# EAGLE design Sensor Board (EAGLE 6.4)

## Sheet 1 of 7: Microcontroller
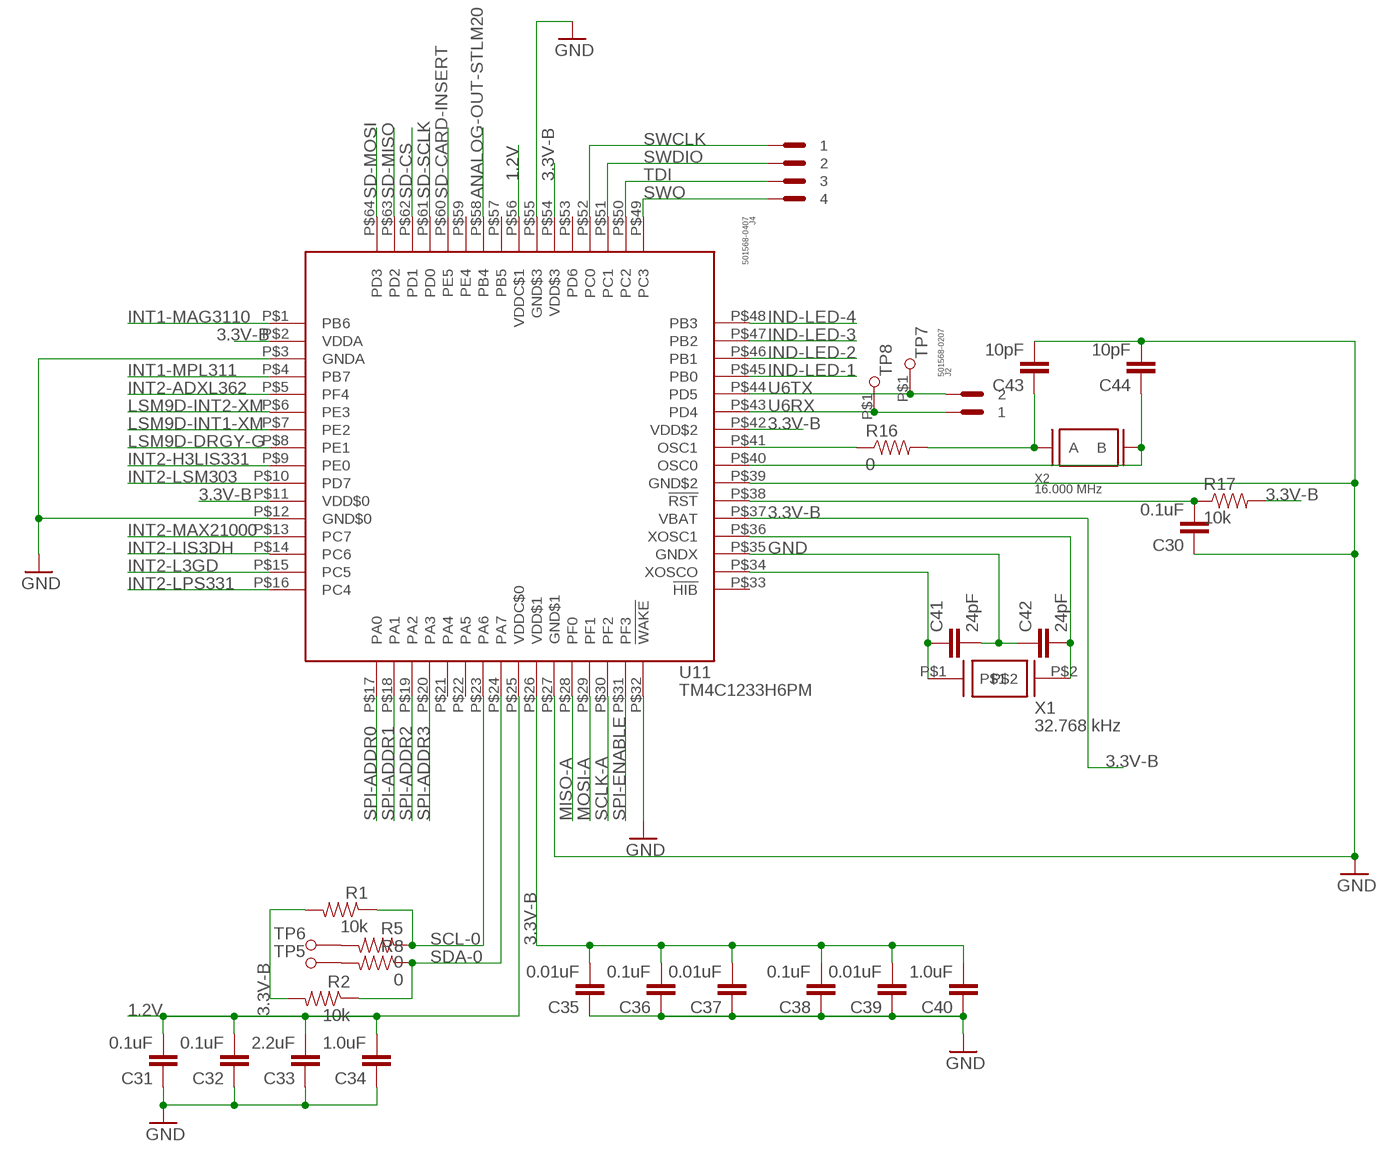
[diagram p0: schematic, sheet 1]

### Parts
C30  0.1uF  CAPACITOR0402  [C0402]
C31  0.1uF  CAPACITOR0402  [C0402]
C32  0.1uF  CAPACITOR0402  [C0402]
C33  2.2uF  CAPACITOR0402  [C0402]
C34  1.0uF  CAPACITOR0402  [C0402]
C35  0.01uF  CAPACITOR0402  [C0402]
C36  0.1uF  CAPACITOR0402  [C0402]
C37  0.01uF  CAPACITOR0402  [C0402]
C38  0.1uF  CAPACITOR0402  [C0402]
C39  0.01uF  CAPACITOR0402  [C0402]
C40  1.0uF  CAPACITOR0402  [C0402]
C41  24pF  CAPACITOR0402  [C0402]
C42  24pF  CAPACITOR0402  [C0402]
C43  10pF  CAPACITOR0402  [C0402]
C44  10pF  CAPACITOR0402  [C0402]
J2  501568-0207  [501568-0207]
J4  501568-0407  [501568-0407]
R1  10k  RESISTOR  [R0402]
R2  10k  RESISTOR  [R0402]
R5  0  RESISTOR  [R0402]
R8  0  RESISTOR  [R0402]
R16  0  RESISTOR  [R0402]
R17  10k  RESISTOR  [R0402]
TP5  TESTPAD(ROUND)  [TESTPAD(ROUND)]
TP6  TESTPAD(ROUND)  [TESTPAD(ROUND)]
TP7  TESTPAD(ROUND)  [TESTPAD(ROUND)]
TP8  TESTPAD(ROUND)  [TESTPAD(ROUND)]
U11  TM4C1233H6PM  [S-PQFP-G64]
X1  32.768 kHz  ABS07L  [2-SMD(3.2X1.5)]
X2  16.000 MHz  NX3225GA  [4-SMD(3.2X2.5)]

### Nets
1.2V: C31.2 C32.2 C33.2 C34.2 U11.P$25(VDDC$0) U11.P$56(VDDC$1)
3.3V-B: C35.2 C36.2 C37.2 C38.2 C39.2 C40.2 R1.2 R2.2 R17.2 U11.P$2(VDDA) U11.P$11(VDD$0) U11.P$26(VDD$1) U11.P$37(VBAT) U11.P$42(VDD$2) U11.P$54(VDD$3) ; also sheet 4,6,7
ANALOG-OUT-STLM20: U11.P$58(PB4) ; also sheet 4
GND: C30.1 C31.1 C32.1 C33.1 C34.1 C35.1 C36.1 C37.1 C38.1 C39.1 C40.1 C41.2 C42.1 C43.2 C44.2 U11.P$3(GNDA) U11.P$12(GND$0) U11.P$27(GND$1) U11.P$32(!WAKE) U11.P$35(GNDX) U11.P$39(GND$2) U11.P$55(GND$3) ; also sheet 2,3,4,5,6,7
IND-LED-1: U11.P$45(PB0) ; also sheet 7
IND-LED-2: U11.P$46(PB1) ; also sheet 7
IND-LED-3: U11.P$47(PB2) ; also sheet 7
IND-LED-4: U11.P$48(PB3) ; also sheet 7
INT1-MAG3110: U11.P$1(PB6) ; also sheet 3
INT1-MPL311: U11.P$4(PB7) ; also sheet 4
INT2-ADXL362: U11.P$5(PF4) ; also sheet 2
INT2-H3LIS331: U11.P$9(PE0) ; also sheet 2
INT2-L3GD: U11.P$15(PC5) ; also sheet 3
INT2-LIS3DH: U11.P$14(PC6) ; also sheet 2
INT2-LPS331: U11.P$16(PC4) ; also sheet 4
INT2-LSM303: U11.P$10(PD7) ; also sheet 3
INT2-MAX21000: U11.P$13(PC7) ; also sheet 3
LSM9D-DRGY-G: U11.P$8(PE1) ; also sheet 5
LSM9D-INT1-XM: U11.P$7(PE2) ; also sheet 5
LSM9D-INT2-XM: U11.P$6(PE3) ; also sheet 5
MISO-A: U11.P$28(PF0) ; also sheet 6
MOSI-A: U11.P$29(PF1) ; also sheet 6
N$10: C30.2 R17.1 U11.P$38(!RST)
N$11: C42.2 U11.P$36(XOSC1) X1.P$2
N$12: C41.1 U11.P$34(XOSCO) X1.P$1
N$14: C43.1 R16.2 X2.P$1(A)
N$16: C44.1 U11.P$40(OSC0) X2.P$3(B)
N$17: R16.1 U11.P$41(OSC1)
N$24: R5.2 TP6.P$1
N$26: R8.2 TP5.P$1
SCL-0: R1.1 R5.1 U11.P$23(PA6) ; also sheet 3,4,5
SCLK-A: U11.P$30(PF2) ; also sheet 6
SD-CARD-INSERT: U11.P$60(PE5) ; also sheet 6
SD-CS: U11.P$62(PD1) ; also sheet 6
SD-MISO: U11.P$63(PD2) ; also sheet 6
SD-MOSI: U11.P$64(PD3) ; also sheet 6
SD-SCLK: U11.P$61(PD0) ; also sheet 6
SDA-0: R2.1 R8.1 U11.P$24(PA7) ; also sheet 3,4,5
SPI-ADDR0: U11.P$17(PA0) ; also sheet 6
SPI-ADDR1: U11.P$18(PA1) ; also sheet 6
SPI-ADDR2: U11.P$19(PA2) ; also sheet 6
SPI-ADDR3: U11.P$20(PA3) ; also sheet 6
SPI-ENABLE: U11.P$31(PF3)
SWCLK: J4.P$1 U11.P$52(PC0)
SWDIO: J4.P$2 U11.P$51(PC1)
SWO: J4.P$4 U11.P$49(PC3)
TDI: J4.P$3 U11.P$50(PC2)
U6RX: J2.P$1 TP8.P$1 U11.P$43(PD4)
U6TX: J2.P$2 TP7.P$1 U11.P$44(PD5)
Unconnected: U11.P$21(PA4) U11.P$22(PA5) U11.P$33(!HIB) U11.P$53(PD6) U11.P$57(PB5) U11.P$59(PE4)

## Sheet 2 of 7: Accelerometer
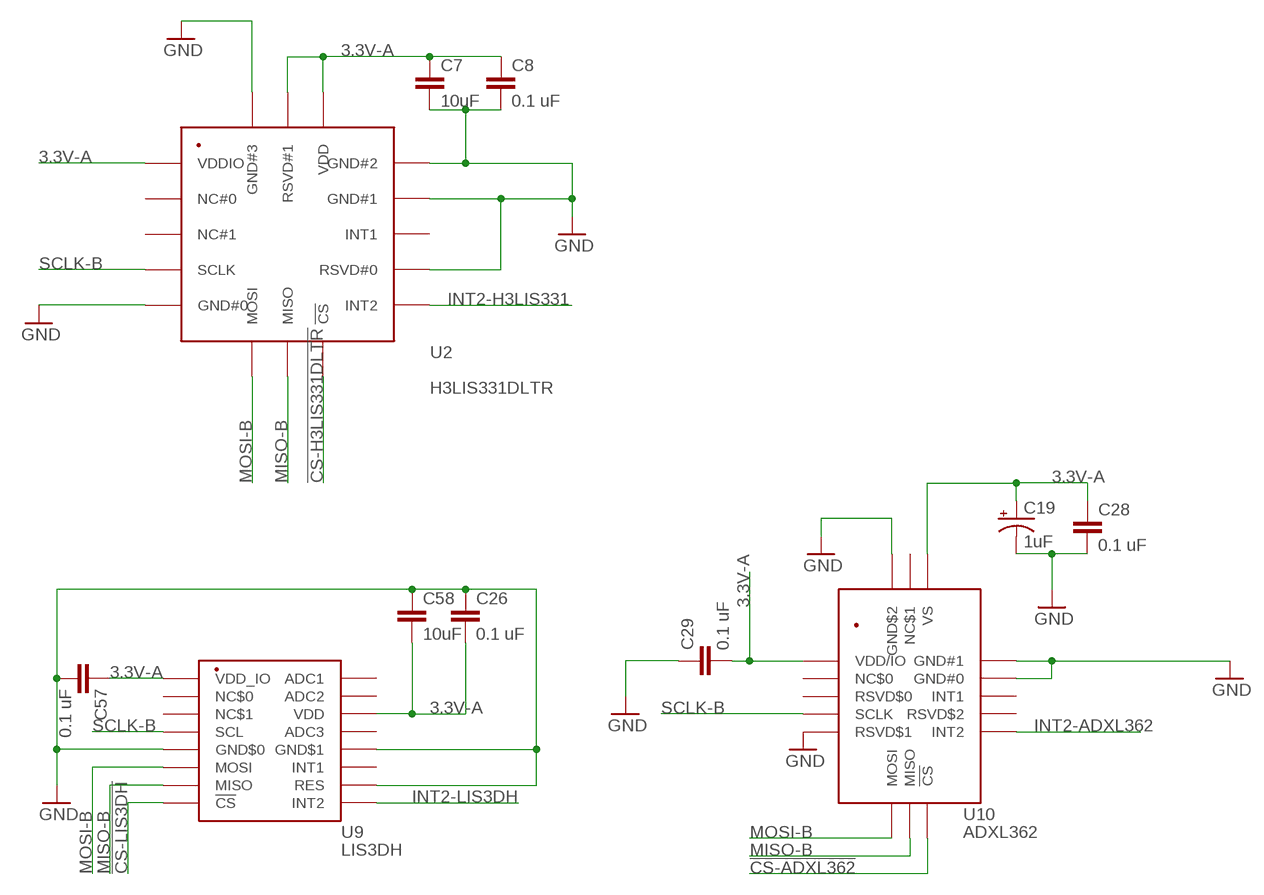
[diagram p1: schematic, sheet 2]

### Parts
C7  10uF  CAPACITOR10U-X5R-10%-6.3V  [C0603]
C8  0.1 uF  CAPACITOR0.1U-X7R-10%-25V  [C0402]
C19  1uF  CAP_POL6032  [EIA6032]
C26  0.1 uF  CAPACITOR0.1U-X7R-10%-25V  [C0402]
C28  0.1 uF  CAPACITOR0.1U-X7R-10%-50V  [C0402]
C29  0.1 uF  CAPACITOR0.1U-X7R-10%-50V  [C0402]
C57  0.1 uF  CAPACITOR0.1U-X7R-10%-25V  [C0402]
C58  10uF  CAPACITOR10U-X5R-10%-6.3V  [C0603]
U2  H3LIS331DLTR  [LGA-16(3X3)]
U9  LIS3DH  [LGA-16(3X3)]
U10  ADXL362  [LGA-16(3X3.25)]

### Nets
3.3V-A: C7.1 C8.1 C19.P$1(+) C26.2 C28.1 C29.2 C57.1 C58.2 U2.P$1(VDDIO) U2.P$14(VDD) U2.P$15(RSVD#1) U9.P$1(VDD_IO) U9.P$14(VDD) U10.P$1(VDD/IO) U10.P$14(VS) ; also sheet 3,4,5,7
!CS-ADXL362: U10.P$8(!CS) ; also sheet 6
!CS-H3LIS331DLTR: U2.P$8(!CS) ; also sheet 6
!CS-LIS3DH: U9.P$8(!CS) ; also sheet 6
GND: C7.2 C8.2 C19.P$2(-) C26.1 C28.2 C29.1 C57.2 C58.1 U2.P$5(GND#0) U2.P$10(RSVD#0) U2.P$12(GND#1) U2.P$13(GND#2) U2.P$16(GND#3) U9.P$5(GND$0) U9.P$10(RES) U9.P$12(GND$1) U10.P$5(RSVD$1) U10.P$12(GND#0) U10.P$13(GND#1) U10.P$16(GND$2) ; also sheet 1,3,4,5,6,7
INT2-ADXL362: U10.P$9(INT2) ; also sheet 1
INT2-H3LIS331: U2.P$9(INT2) ; also sheet 1
INT2-LIS3DH: U9.P$9(INT2) ; also sheet 1
MISO-B: U2.P$7(MISO) U9.P$7(MISO) U10.P$7(MISO) ; also sheet 3,4,5,6
MOSI-B: U2.P$6(MOSI) U9.P$6(MOSI) U10.P$6(MOSI) ; also sheet 3,4,5,6
SCLK-B: U2.P$4(SCLK) U9.P$4(SCL) U10.P$4(SCLK) ; also sheet 3,4,5,6
Unconnected: U2.P$2(NC#0) U2.P$3(NC#1) U2.P$11(INT1) U9.P$2(NC$0) U9.P$3(NC$1) U9.P$11(INT1) U9.P$13(ADC3) U9.P$15(ADC2) U9.P$16(ADC1) U10.P$2(NC$0) U10.P$3(RSVD$0) U10.P$10(RSVD$2) U10.P$11(INT1) U10.P$15(NC$1)

## Sheet 3 of 7: Gyroscopic / Magnetic Sesnors
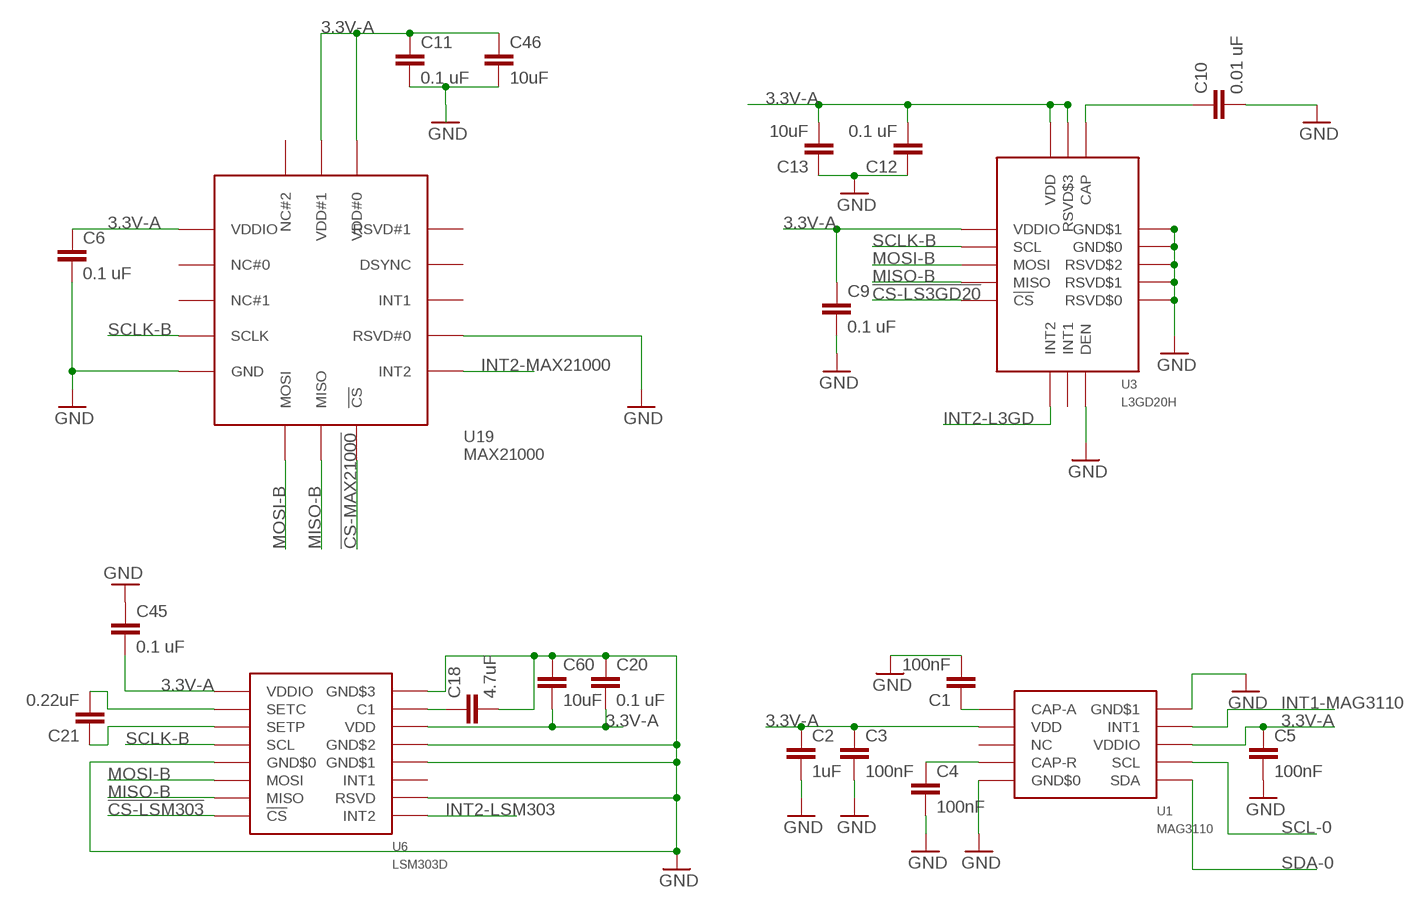
[diagram p2: schematic, sheet 3]

### Parts
C1  100nF  CAPACITOR0402  [C0402]
C2  1uF  CAPACITOR0402  [C0402]
C3  100nF  CAPACITOR0402  [C0402]
C4  100nF  CAPACITOR0402  [C0402]
C5  100nF  CAPACITOR0402  [C0402]
C6  0.1 uF  CAPACITOR0.1U-X7R-10%-10V  [C0402]
C9  0.1 uF  CAPACITOR0.1U-X7R-10%-25V  [C0402]
C10  0.01 uF  CAPACITOR0.01U-X7R-10%-50V  [C0402]
C11  0.1 uF  CAPACITOR0.1U-X7R-10%-10V  [C0402]
C12  0.1 uF  CAPACITOR0.1U-X7R-10%-25V  [C0402]
C13  10uF  CAPACITOR10U-X5R-10%-6.3V  [C0603]
C18  4.7uF  CAPACITOR4.7U-X5R-10%-25V  [C0603]
C20  0.1 uF  CAPACITOR0.1U-X7R-10%-25V  [C0402]
C21  0.22uF  CAPACITOR0.22U-X7R-10%-50V  [C0603]
C45  0.1 uF  CAPACITOR0.1U-X7R-10%-25V  [C0402]
C46  10uF  CAPACITOR10U-X5R-10%-10V  [C0603]
C60  10uF  CAPACITOR10U-X5R-10%-6.3V  [C0603]
U1  MAG3110  [DFN-10(2X2)]
U3  L3GD20H  [LGA-16(3X3)]
U6  LSM303D  [LGA-16(3X3)]
U19  MAX21000  [LGA-16(3X3)]

### Nets
3.3V-A: C2.1 C3.1 C5.1 C6.1 C9.1 C11.1 C12.2 C13.2 C20.2 C45.2 C46.1 C60.2 U1.P$2(VDD) U1.P$8(VDDIO) U3.P$1(VDDIO) U3.P$15(RSVD$3) U3.P$16(VDD) U6.P$1(VDDIO) U6.P$14(VDD) U19.P$1(VDDIO) U19.P$14(VDD#0) U19.P$15(VDD#1) ; also sheet 2,4,5,7
!CS-LS3GD20: U3.P$5(!CS) ; also sheet 6
!CS-LSM303: U6.P$8(!CS) ; also sheet 6
!CS-MAX21000: U19.P$8(!CS) ; also sheet 6
GND: C1.2 C2.2 C3.2 C4.2 C5.2 C6.2 C9.2 C10.2 C11.2 C12.1 C13.1 C18.2 C20.1 C45.1 C46.2 C60.1 U1.P$5(GND$0) U1.P$10(GND$1) U3.P$8(DEN) U3.P$9(RSVD$0) U3.P$10(RSVD$1) U3.P$11(RSVD$2) U3.P$12(GND$0) U3.P$13(GND$1) U6.P$5(GND$0) U6.P$10(RSVD) U6.P$12(GND$1) U6.P$13(GND$2) U6.P$16(GND$3) U19.P$5(GND) U19.P$10(RSVD#0) ; also sheet 1,2,4,5,6,7
INT1-MAG3110: U1.P$9(INT1) ; also sheet 1
INT2-L3GD: U3.P$6(INT2) ; also sheet 1
INT2-LSM303: U6.P$9(INT2) ; also sheet 1
INT2-MAX21000: U19.P$9(INT2) ; also sheet 1
MISO-B: U3.P$4(MISO) U6.P$7(MISO) U19.P$7(MISO) ; also sheet 2,4,5,6
MOSI-B: U3.P$3(MOSI) U6.P$6(MOSI) U19.P$6(MOSI) ; also sheet 2,4,5,6
N$1: C1.1 U1.P$1(CAP-A)
N$3: C4.1 U1.P$4(CAP-R)
N$4: C10.1 U3.P$14(CAP)
N$6: C18.1 U6.P$15(C1)
N$7: C21.2 U6.P$2(SETC)
N$15: C21.1 U6.P$3(SETP)
SCL-0: U1.P$7(SCL) ; also sheet 1,4,5
SCLK-B: U3.P$2(SCL) U6.P$4(SCL) U19.P$4(SCLK) ; also sheet 2,4,5,6
SDA-0: U1.P$6(SDA) ; also sheet 1,4,5
Unconnected: U1.P$3(NC) U3.P$7(INT1) U6.P$11(INT1) U19.P$2(NC#0) U19.P$3(NC#1) U19.P$11(INT1) U19.P$12(DSYNC) U19.P$13(RSVD#1) U19.P$16(NC#2)

## Sheet 4 of 7: Pressure / Temerature Sensors
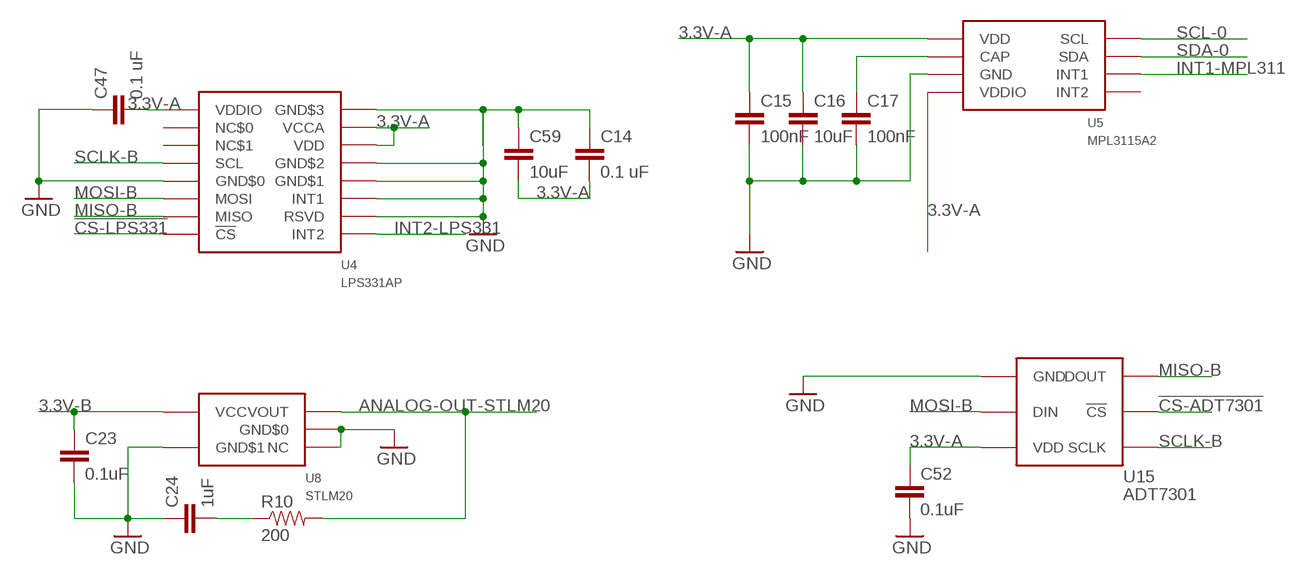
[diagram p3: schematic, sheet 4]

### Parts
C14  0.1 uF  CAPACITOR0.1U-X7R-10%-25V  [C0402]
C15  100nF  CAPACITOR0402  [C0402]
C16  10uF  CAPACITOR0402  [C0402]
C17  100nF  CAPACITOR0402  [C0402]
C23  0.1uF  CAPACITOR0402  [C0402]
C24  1uF  CAPACITOR0402  [C0402]
C47  0.1 uF  CAPACITOR0.1U-X7R-10%-25V  [C0402]
C52  0.1uF  CAPACITOR0402  [C0402]
C59  10uF  CAPACITOR10U-X5R-10%-6.3V  [C0603]
R10  200  RESISTOR  [R0402]
U4  LPS331AP  [LGA-16(3X3)]
U5  MPL3115A2  [LGA-8(5X3)]
U8  STLM20  [SOT323-5L]
U15  ADT7301  [SOT23-6]

### Nets
3.3V-A: C14.2 C15.1 C16.1 C47.2 C52.1 C59.2 U4.P$1(VDDIO) U4.P$14(VDD) U4.P$15(VCCA) U5.P$1(VDD) U5.P$4(VDDIO) U15.P$3(VDD) ; also sheet 2,3,5,7
3.3V-B: C23.1 U8.P$4(VCC) ; also sheet 1,6,7
!CS-ADT7301: U15.P$5(!CS) ; also sheet 6
!CS-LPS331: U4.P$8(!CS) ; also sheet 6
ANALOG-OUT-STLM20: R10.2 U8.P$3(VOUT) ; also sheet 1
GND: C14.1 C15.2 C16.2 C17.2 C23.2 C24.1 C47.1 C52.2 C59.1 U4.P$5(GND$0) U4.P$10(RSVD) U4.P$11(INT1) U4.P$12(GND$1) U4.P$13(GND$2) U4.P$16(GND$3) U5.P$3(GND) U8.P$1(NC) U8.P$2(GND$0) U8.P$5(GND$1) U15.P$1(GND) ; also sheet 1,2,3,5,6,7
INT1-MPL311: U5.P$6(INT1) ; also sheet 1
INT2-LPS331: U4.P$9(INT2) ; also sheet 1
MISO-B: U4.P$7(MISO) U15.P$6(DOUT) ; also sheet 2,3,5,6
MOSI-B: U4.P$6(MOSI) U15.P$2(DIN) ; also sheet 2,3,5,6
N$5: C17.1 U5.P$2(CAP)
N$9: C24.2 R10.1
SCL-0: U5.P$8(SCL) ; also sheet 1,3,5
SCLK-B: U4.P$4(SCL) U15.P$4(SCLK) ; also sheet 2,3,5,6
SDA-0: U5.P$7(SDA) ; also sheet 1,3,5
Unconnected: U4.P$2(NC$0) U4.P$3(NC$1) U5.P$5(INT2)

## Sheet 5 of 7: 9D Sensor / Humidity Sensor
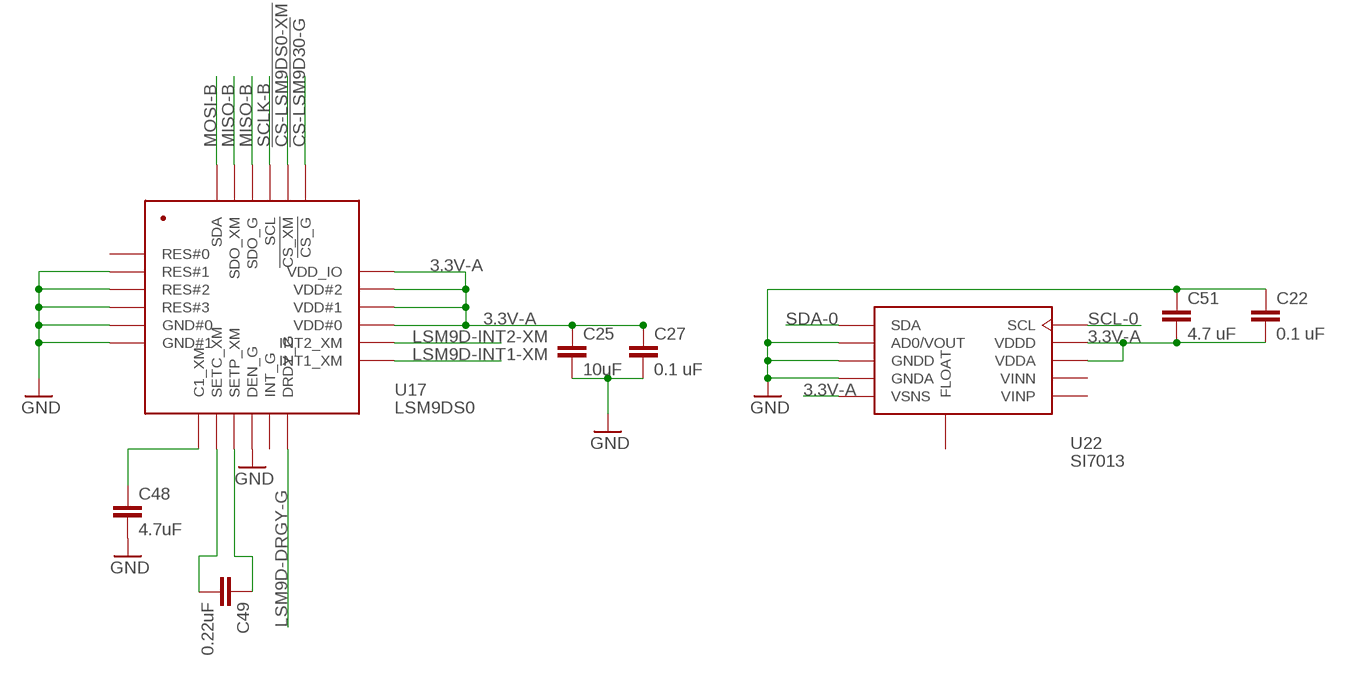
[diagram p4: schematic, sheet 5]

### Parts
C22  0.1 uF  CAPACITOR0.1U-X7R-10%-10V  [C0402]
C25  10uF  CAPACITOR10U-X5R-10%-10V  [C0603]
C27  0.1 uF  CAPACITOR0.1U-X7R-10%-16V  [C0402]
C48  4.7uF  CAPACITOR4.7U-Y5V--20+80-10V  [C0603]
C49  0.22uF  CAPACITOR0402  [C0402]
C51  4.7 uF  CAPACITOR4.7U-X5R-10%-6.3V  [C0402]
U17  LSM9DS0  [LGA-24(4X4)]
U22  SI7013  [DFN-10(3X3)]

### Nets
3.3V-A: C22.2 C25.1 C27.1 C51.2 U17.P$15(VDD#0) U17.P$16(VDD#1) U17.P$17(VDD#2) U17.P$18(VDD_IO) U22.P$5(VSNS) U22.P$8(VDDA) U22.P$9(VDDD) ; also sheet 2,3,4,7
!CS-LSM9D30-G: U17.P$19(!CS_G) ; also sheet 6
!CS-LSM9DS0-XM: U17.P$20(!CS_XM) ; also sheet 6
GND: C22.1 C25.2 C27.2 C48.2 C51.1 U17.P$2(RES#1) U17.P$3(RES#2) U17.P$4(RES#3) U17.P$5(GND#0) U17.P$6(GND#1) U17.P$10(DEN_G) U22.P$2(AD0/VOUT) U22.P$3(GNDD) U22.P$4(GNDA) ; also sheet 1,2,3,4,6,7
LSM9D-DRGY-G: U17.P$12(DRDY_G) ; also sheet 1
LSM9D-INT1-XM: U17.P$13(INT1_XM) ; also sheet 1
LSM9D-INT2-XM: U17.P$14(INT2_XM) ; also sheet 1
MISO-B: U17.P$22(SDO_G) U17.P$23(SDO_XM) ; also sheet 2,3,4,6
MOSI-B: U17.P$24(SDA) ; also sheet 2,3,4,6
N$8: C48.1 U17.P$7(C1_XM)
N$21: C49.2 U17.P$8(SETC_XM)
N$22: C49.1 U17.P$9(SETP_XM)
SCL-0: U22.P$10(SCL) ; also sheet 1,3,4
SCLK-B: U17.P$21(SCL) ; also sheet 2,3,4,6
SDA-0: U22.P$1(SDA) ; also sheet 1,3,4
Unconnected: U17.P$1(RES#0) U17.P$11(INT_G) U22.P$6(VINP) U22.P$7(VINN) U22.P$11(FLOAT)

## Sheet 6 of 7: SPI/SD Comunication
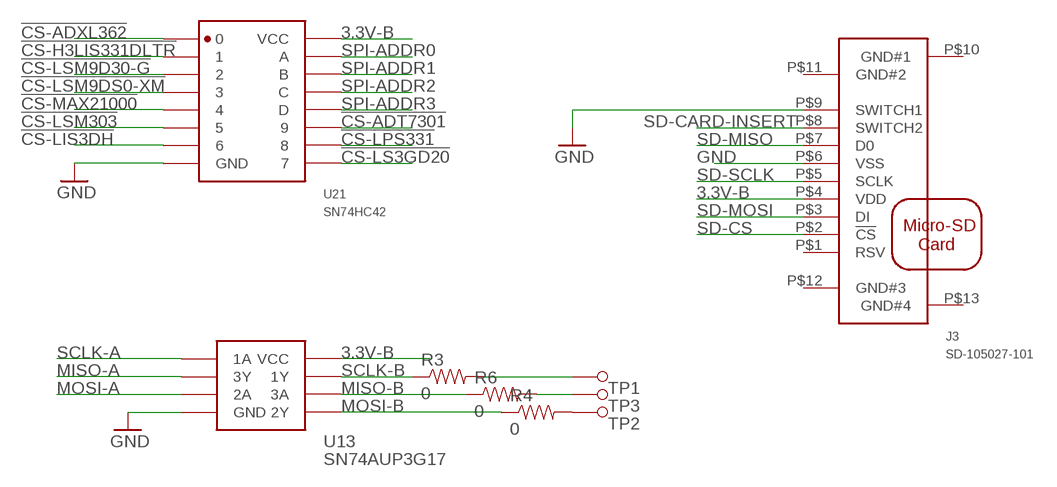
[diagram p5: schematic, sheet 6]

### Parts
J3  SD-105027-101  [SD-105027-1001]
R3  0  RESISTOR  [R0402]
R4  0  RESISTOR  [R0402]
R6  0  RESISTOR  [R0402]
TP1  TESTPAD(ROUND)  [TESTPAD(ROUND)]
TP2  TESTPAD(ROUND)  [TESTPAD(ROUND)]
TP3  TESTPAD(ROUND)  [TESTPAD(ROUND)]
U13  SN74AUP3G17  [8-VFSOP]
U21  SN74HC42  [SOIC-16]

### Nets
3.3V-B: J3.P$4(VDD) U13.P$8(VCC) U21.P$16(VCC) ; also sheet 1,4,7
!CS-ADT7301: U21.P$11 ; also sheet 4
!CS-ADXL362: U21.P$1 ; also sheet 2
!CS-H3LIS331DLTR: U21.P$2 ; also sheet 2
!CS-LIS3DH: U21.P$7 ; also sheet 2
!CS-LPS331: U21.P$10 ; also sheet 4
!CS-LS3GD20: U21.P$9 ; also sheet 3
!CS-LSM9D30-G: U21.P$3 ; also sheet 5
!CS-LSM9DS0-XM: U21.P$4 ; also sheet 5
!CS-LSM303: U21.P$6 ; also sheet 3
!CS-MAX21000: U21.P$5 ; also sheet 3
GND: J3.P$6(VSS) J3.P$9(SWITCH1) U13.P$4(GND) U21.P$8(GND) ; also sheet 1,2,3,4,5,7
MISO-A: U13.P$2(3Y) ; also sheet 1
MISO-B: R6.1 U13.P$6(3A) ; also sheet 2,3,4,5
MOSI-A: U13.P$3(2A) ; also sheet 1
MOSI-B: R4.1 U13.P$5(2Y) ; also sheet 2,3,4,5
N$32: R3.2 TP1.P$1
N$33: R4.2 TP2.P$1
N$34: R6.2 TP3.P$1
SCLK-A: U13.P$1(1A) ; also sheet 1
SCLK-B: R3.1 U13.P$7(1Y) ; also sheet 2,3,4,5
SD-CARD-INSERT: J3.P$8(SWITCH2) ; also sheet 1
SD-CS: J3.P$2(!CS) ; also sheet 1
SD-MISO: J3.P$7(D0) ; also sheet 1
SD-MOSI: J3.P$3(DI) ; also sheet 1
SD-SCLK: J3.P$5(SCLK) ; also sheet 1
SPI-ADDR0: U21.P$15(A) ; also sheet 1
SPI-ADDR1: U21.P$14(B) ; also sheet 1
SPI-ADDR2: U21.P$13(C) ; also sheet 1
SPI-ADDR3: U21.P$12(D) ; also sheet 1
Unconnected: J3.P$1(RSV) J3.P$10(GND#1) J3.P$11(GND#2) J3.P$12(GND#3) J3.P$13(GND#4)

## Sheet 7 of 7: Power / Indicator LEDs
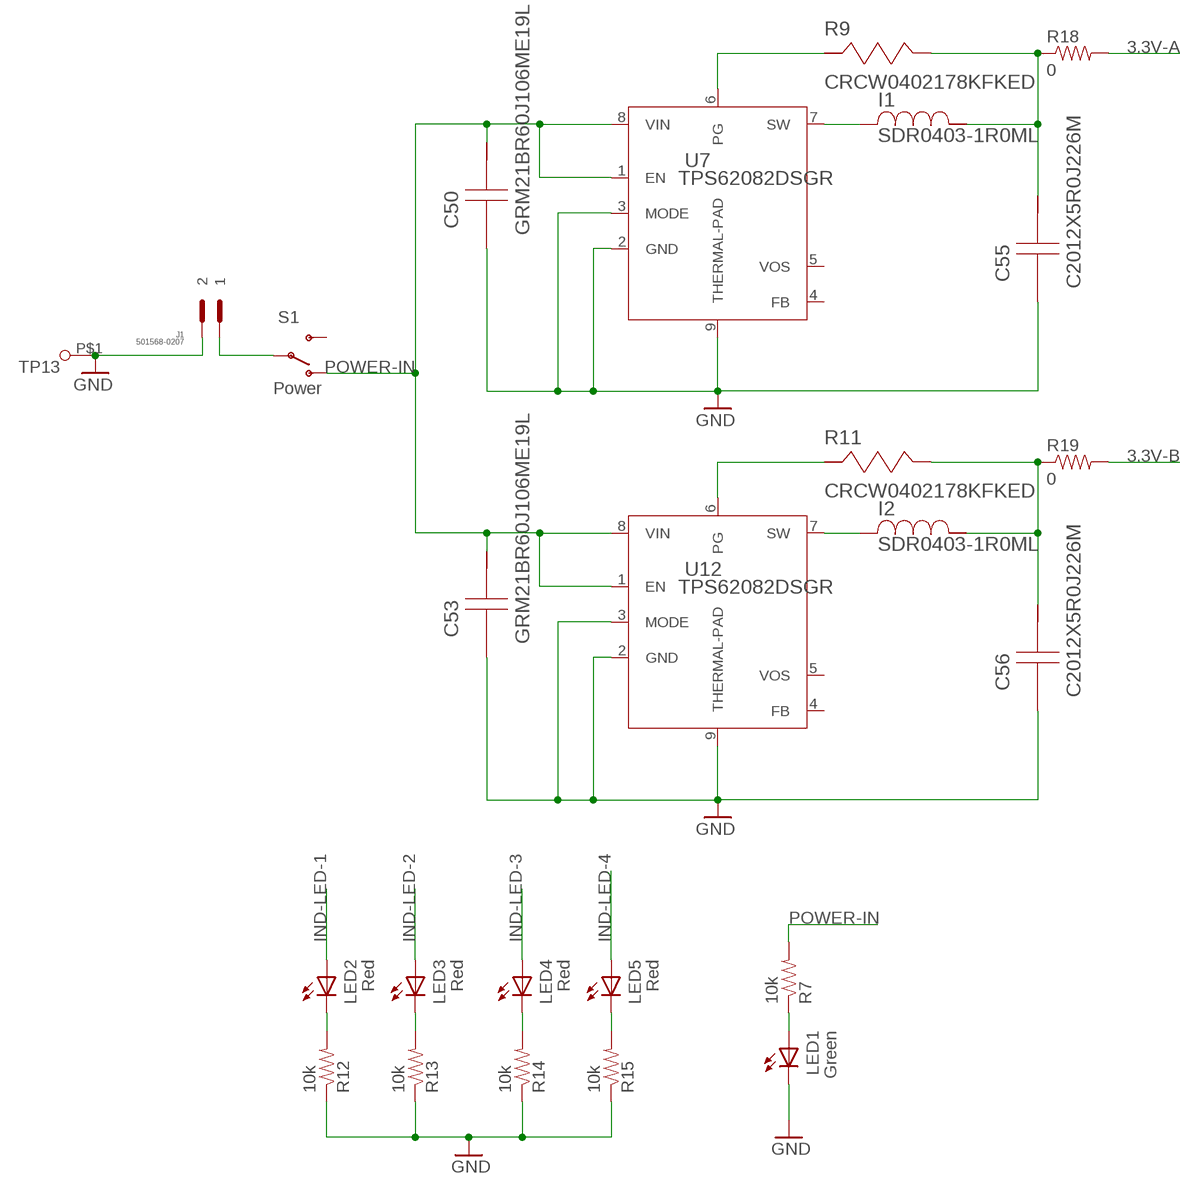
[diagram p6: schematic, sheet 7]

### Parts
C50  GRM21BR60J106ME19L  [0805]
C53  GRM21BR60J106ME19L  [0805]
C55  C2012X5R0J226M  [0805]
C56  C2012X5R0J226M  [0805]
I1  SDR0403-1R0ML  [SDR0403]
I2  SDR0403-1R0ML  [SDR0403]
J1  501568-0207  [501568-0207]
LED1  Green  LEDG  [LED_0402]
LED2  Red  LEDR  [LED_0402]
LED3  Red  LEDR  [LED_0402]
LED4  Red  LEDR  [LED_0402]
LED5  Red  LEDR  [LED_0402]
R7  10k  RESISTOR  [R0402]
R9  CRCW0402178KFKED  [0402]
R11  CRCW0402178KFKED  [0402]
R12  10k  RESISTOR  [R0402]
R13  10k  RESISTOR  [R0402]
R14  10k  RESISTOR  [R0402]
R15  10k  RESISTOR  [R0402]
R18  0  RESISTOR0603-RES  [0603-RES]
R19  0  RESISTOR0603-RES  [0603-RES]
S1  Power  SWITCH-SPDT-SMD-A  [SWITCH-SPST-SMD-A]
TP13  TESTPAD(ROUND)  [TESTPAD(ROUND)]
U7  TPS62082DSGR  [S-PWSON-N8]
U12  TPS62082DSGR  [S-PWSON-N8]

### Nets
3.3V-A: R18.2 ; also sheet 2,3,4,5
3.3V-B: R19.2 ; also sheet 1,4,6
GND: C50.2 C53.2 C55.2 C56.2 J1.P$2 LED1.C R12.1 R13.1 R14.1 R15.1 TP13.P$1 U7.2(GND) U7.3(MODE) U7.9(THERMAL-PAD) U12.2(GND) U12.3(MODE) U12.9(THERMAL-PAD) ; also sheet 1,2,3,4,5,6
IND-LED-1: LED2.A ; also sheet 1
IND-LED-2: LED3.A ; also sheet 1
IND-LED-3: LED4.A ; also sheet 1
IND-LED-4: LED5.A ; also sheet 1
N$2: J1.P$1 S1.2(P)
N$13: I1.2 U7.7(SW)
N$18: LED5.C R15.2
N$19: C55.1 I1.1 R9.1 R18.1
N$23: R9.2 U7.6(PG)
N$25: C56.1 I2.1 R11.1 R19.1
N$27: LED1.A R7.1
N$29: LED4.C R14.2
N$31: LED3.C R13.2
N$35: LED2.C R12.2
N$36: I2.2 U12.7(SW)
N$37: R11.2 U12.6(PG)
POWER-IN: C50.1 C53.1 R7.2 S1.1(O) U7.1(EN) U7.8(VIN) U12.1(EN) U12.8(VIN)
Unconnected: S1.3(S) U7.4(FB) U7.5(VOS) U12.4(FB) U12.5(VOS)

## Library data of the parts
C1-C5 C15-C17 C23 C24 C30-C44 C49 C52 = Kas-Passives:CAPACITOR: Ceramic SMT Capacitor
C6 C11 C22 = Kas-Passives:CAPACITOR: Ceramic SMT Capacitor; DIELECTRIC: X7R; MANUFACTURER: MURATA; MANUFACTURER_PART_NUMBER: GRM155R71A104KA01D; NEWARK_PART_NUMBER: 14T3276; TEMPERATURE: -55 ~ 125; TOLARANCE: 10%; VOLTAGE: 10
C7 C13 C58-C60 = Kas-Passives:CAPACITOR: Ceramic SMT Capacitor; DIELECTRIC: X5R; MANUFACTURER: TDK; MANUFACTURER_PART_NUMBER: C1608X5R0J106K080AB; NEWARK_PART_NUMBER: 04X3239; TEMPERATURE: -55 ~ 85; TOLARANCE: 10%; VOLTAGE: 6.3
C8 C9 C12 C14 C20 C26 C45 C47 C57 = Kas-Passives:CAPACITOR: Ceramic SMT Capacitor; DIELECTRIC: X7R; MANUFACTURER: TDK; MANUFACTURER_PART_NUMBER: CGA2B3X7R1E104K050BB; NEWARK_PART_NUMBER: 04X3147; TEMPERATURE: -55 ~ 125; TOLARANCE: 10%; VOLTAGE: 25
C10 = Kas-Passives:CAPACITOR: Ceramic SMT Capacitor; DIELECTRIC: X7R; MANUFACTURER: MURATA; MANUFACTURER_PART_NUMBER: GRM155R71H103KA88D; NEWARK_PART_NUMBER: 14T3284; TEMPERATURE: -55 ~ 125; TOLARANCE: 10%; VOLTAGE: 50
C18 = Kas-Passives:CAPACITOR: Ceramic SMT Capacitor; DIELECTRIC: X5R; MANUFACTURER: MURATA; MANUFACTURER_PART_NUMBER: GRM188R61E475KE11D; NEWARK_PART_NUMBER: 68X2788; TEMPERATURE: -55 ~ 85; TOLARANCE: 10%; VOLTAGE: 25
C19 = SparkFun-Passives:CAP_POL: Capacitor Polarized These are standard SMD and PTH capacitors. Normally 10uF, 47uF, and 100uF in electrolytic and tantalum varieties. Always verify the external diameter of the through hole cap, it varies with capacity, voltage, and manufacturer. The EIA devices should be standard.
C21 = Kas-Passives:CAPACITOR: Ceramic SMT Capacitor; DIELECTRIC: X7R; MANUFACTURER: Taiyo Yuden; MANUFACTURER_PART_NUMBER: UMK107B7224KA-TR; NEWARK_PART_NUMBER: 29X1406; TEMPERATURE: -55 ~ 125; TOLARANCE: 10%; VOLTAGE: 50
C25 C46 = Kas-Passives:CAPACITOR: Ceramic SMT Capacitor; DIELECTRIC: X5R; MANUFACTURER: TDK; MANUFACTURER_PART_NUMBER: C1068X5R1A106K080AC; NEWARK_PART_NUMBER: 04X3243; TEMPERATURE: -55 ~ 85; TOLARANCE: 10%; VOLTAGE: 10
C27 = Kas-Passives:CAPACITOR: Ceramic SMT Capacitor; DIELECTRIC: X7R; MANUFACTURER: AVX; MANUFACTURER_PART_NUMBER: 0402YC104KAT2A; NEWARK_PART_NUMBER: 09R7024; TEMPERATURE: -55 ~ 125; TOLARANCE: 10%; VOLTAGE: 16
C28 C29 = Kas-Passives:CAPACITOR: Ceramic SMT Capacitor; DIELECTRIC: X7R; MANUFACTURER: TDK; MANUFACTURER_PART_NUMBER: C1005X7R1H104K050BB; NEWARK_PART_NUMBER: 04X3230; TEMPERATURE: -55 ~ 125; TOLARANCE: 10%; VOLTAGE: 50
C48 = Kas-Passives:CAPACITOR: Ceramic SMT Capacitor; DIELECTRIC: Y5V; MANUFACTURER: MURATA; MANUFACTURER_PART_NUMBER: GRM21BF51A475ZA01L; NEWARK_PART_NUMBER: 14T3337; TEMPERATURE: -30 ~ 85; TOLARANCE: -20 ~ +80%; VOLTAGE: 10
C50 C53 = Power Regulator:GRM21BR60J106ME19L; CAP: 1.0E-5; ESR: 0.0030; IRMS: 0.0; MANUFACTURER_NAME: MuRata; MANUFACTURER_PART_NUMBER: GRM21BR60J106ME19L; VDC: 6.3; VENDOR: MuRata
C51 = Kas-Passives:CAPACITOR: Ceramic SMT Capacitor; DIELECTRIC: X5R; MANUFACTURER: TDK; MANUFACTURER_PART_NUMBER: C1005X5R0J475K050BC; NEWARK_PART_NUMBER: 04X3211; TEMPERATURE: -55 ~ 85; TOLARANCE: 10%; VOLTAGE: 6.3
C55 C56 = Power Regulator:C2012X5R0J226M; CAP: 2.2E-5; ESR: 0.0018; IRMS: 0.0; MANUFACTURER_NAME: TDK; MANUFACTURER_PART_NUMBER: C2012X5R0J226M; VDC: 6.3; VENDOR: TDK
I1 I2 = Power Regulator:SDR0403-1R0ML; DCR: 0.033; IDC: 3.8; L: 1.0E-6; MANUFACTURER_NAME: Bourns; MANUFACTURER_PART_NUMBER: SDR0403-1R0ML; VENDOR: Bourns
J1 J2 = Kas-Connectors:501568-0207: 1.00mm Pitch Pico-Clasp™ Wire-to-Board Header, Surface Mount, Single Row, Right Angle, with Friction Lock, 2 Circuits, Lead-Free
J3 = Kas-Connectors:SD-105027-101: 1.10mm, 0.76mm, 0.70mm Pitch microSD Card Header with Detect Switch (Pin 8), Height 1.70mm, Lead-Free, 0.102µm Gold (Au) Plating
J4 = Kas-Connectors:501568-0407: 1.00mm Pitch Pico-Clasp™ Wire-to-Board Header, Surface Mount, Single Row, Right Angle, with Friction Lock, 4 Circuits, Lead-Free
LED1 = Kas-Diodes-LEDs:LED: 1.0X0.5MM ULTRA THIN SMD LED. Lens Type : Water Clear; MANUFACTURER: Knightbright; PART_NUMBER: APG1005CGC-T
LED2-LED5 = Kas-Diodes-LEDs:LED: 1.0X0.5MM ULTRA THIN SMD LED. Lens Type : Water Clear; MANUFACTURER: Knightbright; PART_NUMBER: APG1005SEC/E-T
R1-R8 R10 R12-R17 = Kas-Passives:RESISTOR: 0402 Resistor
R9 R11 = Power Regulator:CRCW0402178KFKED; MANUFACTURER_NAME: Vishay-Dale; MANUFACTURER_PART_NUMBER: CRCW0402178KFKED; POWER: 0.063; RESISTANCE: 178000.0; TOLERANCE: 1.0; VENDOR: Vishay-Dale
R18 R19 = SparkFun-Passives:RESISTOR: Resistor Basic schematic elements and footprints for 0603, 1206, and PTH resistors.
S1 = SparkFun-Electromechanical:SWITCH-SPDT: SPDT Switch Simple slide switch, Spark Fun Electronics SKU : COM-00102 DPDT SMT slide switch, AYZ0202, SWCH-08179
TP1-TP3 TP5 TP6 = Kas-Connectors:TESTPAD(ROUND): Rount SMD test point with a 2.8mm footprint
TP7 TP8 TP13 = Kas-Passives:TESTPAD(ROUND)
U1 = Kas-Sensors:MAG3110: MAG3110 Magnotometer MAG3110: Xtrinsic High Accuracy, 3D Magnetometer
U2 = Kas-Sensors:H3LIS331DLTR: H3LIS331DLTR Accelorometer MEMS motion sensor: low-power high-g 3-axis digital accelerometer
U3 = Kas-Sensors:L3GD20H: L3GD20H Gyroscope MEMS motion sensor: three-axis digital output gyroscope
U4 = Kas-Sensors:LPS331AP: LPS331AP Pressure sensor MEMS pressure sensor, 260-1260 mbar absolute digital output barometer
U5 = Kas-Sensors:MPL3115A2: MPL3115A2 Pressure sensor MPL3115A2: 50 to 110kPa, 2.5v, Absolute Xtrinsic Smart Pressure Sensor
U6 = Kas-Sensors:LSM303D: LSM303D Magitometer & Accelorometer Ultra compact high performance e-compass: 3D accelerometer and 3D magnetometer module
U7 U12 = Power Regulator:TPS62082DSGR; DATASHEETURL: http://www.ti.com/product/tps62082; FREQUENCY: 3100000.0; IMAX: 1.2; MANUFACTURER_NAME: Texas Instruments; MANUFACTURER_PART_NUMBER: TPS62082DSGR; MKTG_PACKAGE: TPS62082; NSID: TPS62082DSG; PACKAGE: TPS62082; VENDOR: Texas Instruments
U8 = Kas-Sensors:STLM20: STLM20 Temerature sensor Ultra-low current 2.4 V precision analog temperature sensor
U9 = Kas-Sensors:LIS3DH: LIS3DH Accelorometer MEMS digital output motion sensor ultra low-power high performance 3-axes "nano" accelerometer
U10 = Kas-Sensors:ADXL362: ADXL362 Accelorometer ADXL362: MICROPOWER, 3-AXIS, ±2 g/±4 g/±8 g DIGITAL OUTPUT MEMS ACCELEROMETER
U11 = Kas-Microcontroller:TM4C1233H6PM: TM4C1233H6PM in a 10.2x10.2 S-PQFP-G64 package
U13 = Kas-Buffers & Level Shifters:SN74AUP3G17: LOW-POWER TRIPLE SCHMITT-TRIGGER BUFFER
U15 = Kas-Sensors:ADT7301: ADT7301 Temperature sensor ADT7301: 13-BIT, ±1ºC ACCURATE, MICROPOWER DIGITAL TEMPERATURE SENSOR IN 6-LEAD SOT-23 AND 8-LEAD MSOP
U17 = Kas-Sensors:LSM9DS0: LSM9DS0 9D sensor iNEMO inertial module:3D accelerometer, 3D gyroscope, 3D magnetometer
U19 = Kas-Sensors:MAX21000: MAX21000 Gyroscope Ultra-Accurate, Low Power, 3-Axis Digital Output Gyroscope
U21 = Kas-Buffers & Level Shifters:SN74HC42: SN74HC42 in a SOIC-16 package (4:10 Decoder)
U22 = Kas-Sensors:SI7013: Si7013 Humidity sensor ​Si7013 2nd Generation Relative Humidity and Temperature Sensors
X1 = Kas-Crystal:ABS07L: SMD Ultra Low Profile Crystal, 32.768kHz LC (pF) 9, 7, 12.5 FT (ppm) 20, 30
X2 = Kas-Crystal:NX3225GA: NX3225GA Crystal (16MHz, 25MHz)

## Board
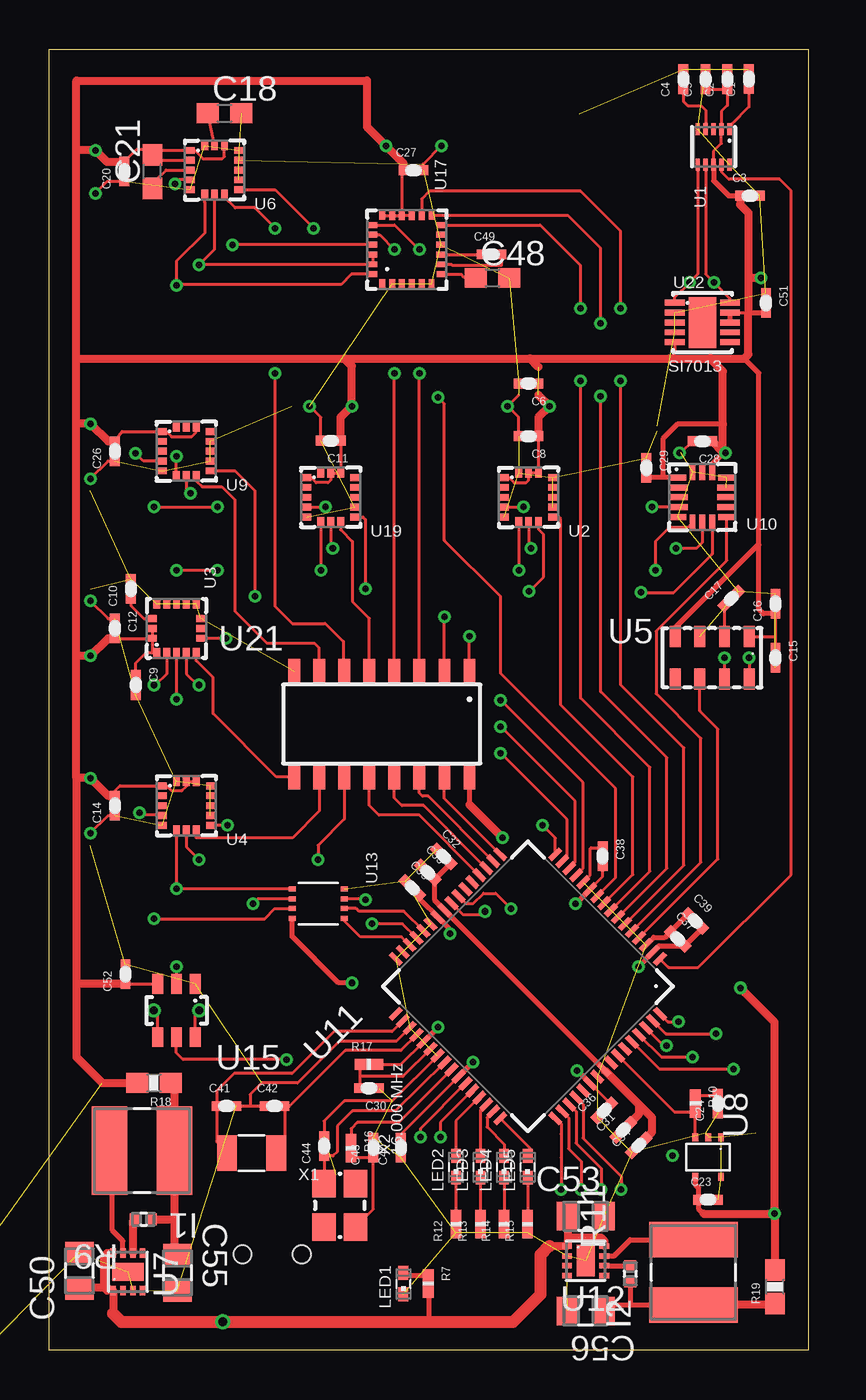
[diagram p7: board, top side]
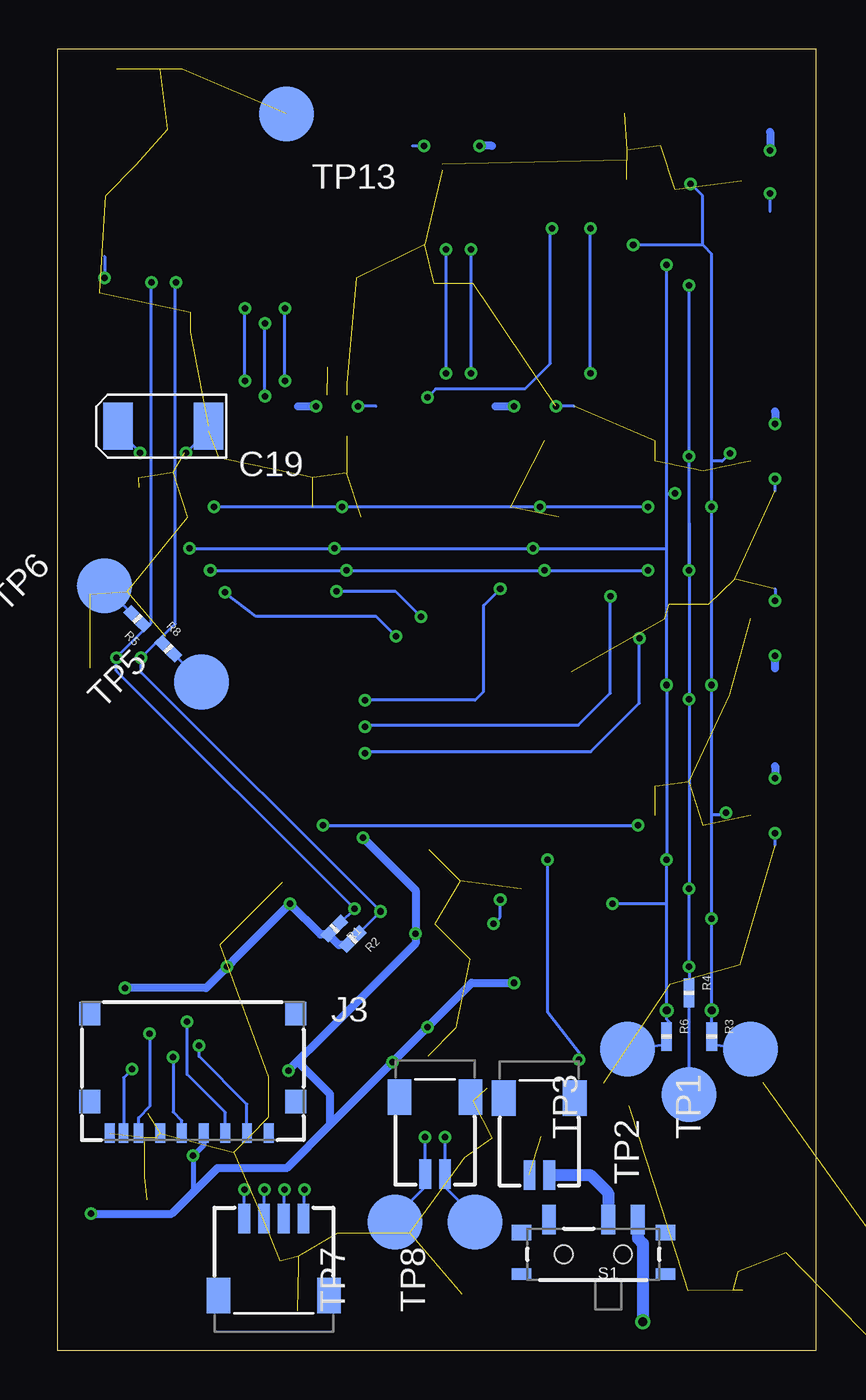
[diagram p8: board, bottom side, seen from below]

Size 38.5 x 66 mm. Coordinates in mm from the lower left corner, seen from the top.
Outline: 38.5,0 0,0 0,66 38.5,66 38.5,0
Copper layers (1*2*15*16): Top 0.035mm / dielectric 0.2mm / Route2 0.0175mm / dielectric 1.1mm / Route15 0.0175mm / dielectric 0.2mm / Bottom 0.035mm
Design rules "SeeedStudio_DRU_no_angle_20130527": minimum track width 6mil, minimum drill 12mil, track to track 6mil, track to pad 6mil, pad to pad 6mil, via to via 6mil, smd to smd 0mil, copper to edge 10mil, drill to drill 10mil, minimum pad ring 6mil, minimum via ring 6mil, stop-mask expansion 2mil, vias tented up to drill 25mil, thermal gap 10mil

### Footprints (pad centres in the part's own frame; a part is rotated, then mirrored left to right if it is on the bottom)
C0402 = smd 0.5 x 0.5: 1 -0.5,0; 2 0.5,0
C0603 = smd 1.1 x 1: 1 -0.85,0; 2 0.85,0
EIA6032 = smd 1.5 x 2.4: P$1 -2.3,0; P$2 2.3,0
0805 = smd 1.118 x 1.448: 1 -0.914,0; 2 0.914,0
SDR0403 = smd 1.803 x 4.496: 1 -1.651,0; 2 1.651,0
501568-0207 = smd 0.6 x 1.5: P$1 -0.5,3.9; P$2 0.5,3.9 | smd 1.2 x 1.8: P$5 -1.8,0; P$6 1.8,0
SD-105027-1001 = smd 0.5 x 1: P$1 3.85,-6.66; P$2 2.75,-6.66; P$3 1.65,-6.66; P$4 0.55,-6.66; P$5 -0.55,-6.66; P$6 -1.65,-6.66; P$7 -2.75,-6.66; P$8 -3.51,-6.66; P$9 -4.21,-6.66 | smd 1.05 x 1.2: P$10 -5.225,-0.6; P$11 -5.225,-5.05; P$12 5.225,-5.05; P$13 5.225,-0.6
501568-0407 = smd 0.6 x 1.5: P$1 -1.5,3.9; P$2 -0.5,3.9; P$3 0.5,3.9; P$4 1.5,3.9 | smd 1.2 x 1.8: P$5 -2.8,0; P$6 2.8,0
LED_0402 = smd 0.7 x 0.5: A 0.55,0; C -0.55,0
R0402 = smd 0.6 x 0.55: 1 -0.425,0; 2 0.425,0
0402 = smd 0.559 x 0.61: 1 -0.406,0; 2 0.406,0
0603-RES = smd 1.1 x 1: 1 -0.85,0; 2 0.85,0
SWITCH-SPST-SMD-A = smd 0.7 x 1.5: 1 -2.25,-1.75; 2 -0.75,-1.75; 3 2.25,-1.75 | smd 1 x 0.6: GND1 -3.65,1; GND3 3.65,1 | smd 1 x 0.8: GND2 -3.65,-1.1; GND4 3.65,-1.1 | hole 0.9: -1.5,0; 1.5,0
TESTPAD(ROUND) = smd 2.794 x 2.794: P$1 0,0
DFN-10(2X2) = smd 0.6 x 0.225: P$1 -0.9,0.8; P$2 -0.9,0.4; P$3 -0.9,0; P$4 -0.9,-0.4; P$5 -0.9,-0.8; P$6 0.9,-0.8; P$7 0.9,-0.4; P$8 0.9,0; P$9 0.9,0.4; P$10 0.9,0.8
LGA-16(3X3) = smd 0.45 x 0.345: P$1 -1.225,1; P$2 -1.225,0.5; P$3 -1.225,0; P$4 -1.225,-0.5; P$5 -1.225,-1; P$9 1.225,-1; P$10 1.225,-0.5; P$11 1.225,0; P$12 1.225,0.5; P$13 1.225,1 | smd 0.345 x 0.45: P$6 -0.5,-1.225; P$7 0,-1.225; P$8 0.5,-1.225; P$14 0.5,1.225; P$15 0,1.225; P$16 -0.5,1.225
LGA-8(5X3) = smd 0.55 x 1.05: P$1 -1.875,-1.075; P$2 -0.625,-1.075; P$3 0.625,-1.075; P$4 1.875,-1.075; P$5 1.875,1.075; P$6 0.625,1.075; P$7 -0.625,1.075; P$8 -1.875,1.075
S-PWSON-N8 = smd 0.5 x 0.28: 1 -0.95,0.75; 2 -0.95,0.25; 3 -0.95,-0.25; 4 -0.95,-0.75; 5 0.95,-0.75; 6 0.95,-0.25; 7 0.95,0.25; 8 0.95,0.75 | smd 0.9 x 1.6: 9 0,0
SOT323-5L = smd 0.4 x 0.3: P$1 1,-0.65; P$2 1,0; P$3 1,0.65; P$4 -1,0.65; P$5 -1,-0.65
LGA-16(3X3.25) = smd 0.865 x 0.3: P$1 -1.242,1; P$5 -1.242,-1; P$9 1.242,-1; P$13 1.242,1 | smd 0.925 x 0.3: P$2 -1.212,0.5; P$3 -1.212,0; P$4 -1.212,-0.5; P$10 1.212,-0.5; P$11 1.212,0; P$12 1.212,0.5 | smd 0.3 x 0.8: P$6 -0.5,-1.275; P$7 0,-1.275; P$8 0.5,-1.275; P$14 0.5,1.275; P$15 0,1.275; P$16 -0.5,1.275
S-PQFP-G64 = smd 0.75 x 0.27: P$1 -5.725,3.75; P$2 -5.725,3.25; P$3 -5.725,2.75; P$4 -5.725,2.25; P$5 -5.725,1.75; P$6 -5.725,1.25; P$7 -5.725,0.75; P$8 -5.725,0.25; P$9 -5.725,-0.25; P$10 -5.725,-0.75; P$11 -5.725,-1.25; P$12 -5.725,-1.75; P$13 -5.725,-2.25; P$14 -5.725,-2.75; P$15 -5.725,-3.25; P$16 -5.725,-3.75; P$33 5.725,-3.75; P$34 5.725,-3.25; P$35 5.725,-2.75; P$36 5.725,-2.25; P$37 5.725,-1.75; P$38 5.725,-1.25; P$39 5.725,-0.75; P$40 5.725,-0.25; P$41 5.725,0.25; P$42 5.725,0.75; P$43 5.725,1.25; P$44 5.725,1.75; P$45 5.725,2.25; P$46 5.725,2.75; P$47 5.725,3.25; P$48 5.725,3.75 | smd 0.27 x 0.75: P$17 -3.75,-5.725; P$18 -3.25,-5.725; P$19 -2.75,-5.725; P$20 -2.25,-5.725; P$21 -1.75,-5.725; P$22 -1.25,-5.725; P$23 -0.75,-5.725; P$24 -0.25,-5.725; P$25 0.25,-5.725; P$26 0.75,-5.725; P$27 1.25,-5.725; P$28 1.75,-5.725; P$29 2.25,-5.725; P$30 2.75,-5.725; P$31 3.25,-5.725; P$32 3.75,-5.725; P$49 3.75,5.725; P$50 3.25,5.725; P$51 2.75,5.725; P$52 2.25,5.725; P$53 1.75,5.725; P$54 1.25,5.725; P$55 0.75,5.725; P$56 0.25,5.725; P$57 -0.25,5.725; P$58 -0.75,5.725; P$59 -1.25,5.725; P$60 -1.75,5.725; P$61 -2.25,5.725; P$62 -2.75,5.725; P$63 -3.25,5.725; P$64 -3.75,5.725
8-VFSOP = smd 0.25 x 0.35: P$1 -0.75,-1.325; P$2 -0.25,-1.325; P$3 0.25,-1.325; P$4 0.75,-1.325; P$5 0.75,1.325; P$6 0.25,1.325; P$7 -0.25,1.325; P$8 -0.75,1.325
SOT23-6 = smd 0.55 x 1: P$1 0.95,1.35; P$2 0,1.35; P$3 -0.95,1.35; P$4 -0.95,-1.35; P$5 0,-1.35; P$6 0.95,-1.35
LGA-24(4X4) = smd 0.432 x 0.3: P$1 -1.725,1.25; P$6 -1.725,-1.25; P$13 1.725,-1.25; P$18 1.725,1.25 | smd 0.45 x 0.3: P$2 -1.725,0.75; P$3 -1.725,0.25; P$4 -1.725,-0.25; P$5 -1.725,-0.75; P$14 1.725,-0.75; P$15 1.725,-0.25; P$16 1.725,0.25; P$17 1.725,0.75 | smd 0.3 x 0.432: P$7 -1.25,-1.725; P$12 1.25,-1.725; P$19 1.25,1.725; P$24 -1.25,1.725 | smd 0.3 x 0.45: P$8 -0.75,-1.725; P$9 -0.25,-1.725; P$10 0.25,-1.725; P$11 0.75,-1.725; P$20 0.75,1.725; P$21 0.25,1.725; P$22 -0.25,1.725; P$23 -0.75,1.725
SOIC-16 = smd 0.6 x 1.27: P$1 -4.445,-2.675; P$2 -3.175,-2.675; P$3 -1.905,-2.675; P$4 -0.635,-2.675; P$5 0.635,-2.675; P$6 1.905,-2.675; P$7 3.175,-2.675; P$8 4.445,-2.675; P$9 4.445,2.675; P$10 3.175,2.675; P$11 1.905,2.675; P$12 0.635,2.675; P$13 -0.635,2.675; P$14 -1.905,2.675; P$15 -3.175,2.675; P$16 -4.445,2.675
DFN-10(3X3) = smd 1 x 0.3: P$1 -1.4,1; P$2 -1.4,0.5; P$3 -1.4,0; P$4 -1.4,-0.5; P$5 -1.4,-1; P$6 1.4,-1; P$7 1.4,-0.5; P$8 1.4,0; P$9 1.4,0.5; P$10 1.4,1 | smd 1.4 x 2.6: P$11 0,0
2-SMD(3.2X1.5) = smd 1 x 1.8: P$1 -1.25,0; P$2 1.25,0
4-SMD(3.2X2.5) = smd 1.4 x 1.2: P$1 -1.1,-0.8; P$2 1.1,-0.8; P$3 1.1,0.8; P$4 -1.1,0.8

### Placement (x,y rotation side)
C1  35.48,64.49 90 top
C2  34.39,64.48 90 top
C3  35.53,58.56 0 top
C4  32.16,64.48 90 top
C5  33.28,64.48 90 top
C6  24.31,49.04 180 top
C7  -14.23,-19.33 0 top  (outside the outline)
C8  24.31,46.37 180 top
C9  4.39,33.75 270 top
C10  4.14,38.62 90 top
C11  14.27,46.14 180 top
C12  3.33,36.62 270 top
C13  -14.23,-31.73 0 top  (outside the outline)
C14  3.33,27.63 90 top
C15  36.83,35.12 270 top
C16  36.83,37.86 90 top
C17  34.59,38.14 45 top
C18  8.89,62.76 0 top
C19  33.12,46.88 0 bottom
C20  3.81,59.8 90 top
C21  5.23,59.8 90 top
C22  -14.12,-52.53 0 top  (outside the outline)
C23  33.42,7.64 0 top
C24  33.9,12.51 90 top
C25  -14.23,-44.12 0 top  (outside the outline)
C26  3.33,45.61 90 top
C27  18.46,59.86 0 top
C28  33.12,46.12 180 top
C29  30.28,44.77 270 top
C30  16.2,13.29 180 top
C31  29.1,11.18 45 top
C32  20,25.05 315 top
C33  19.2,24.25 315 top
C34  29.89,10.39 45 top
C35  18.41,23.46 315 top
C36  28.15,12.16 45 top
C37  31.87,20.87 315 top
C38  28.07,25.06 270 top
C39  32.75,21.78 315 top
C40  17.83,10.28 90 top
C41  8.99,12.39 0 top
C42  11.43,12.39 0 top
C43  16.43,10.28 90 top
C44  13.94,10.35 90 top
C45  -14.12,-35.38 0 top  (outside the outline)
C46  -14.23,-48.87 0 top  (outside the outline)
C47  -14.12,-22.99 0 top  (outside the outline)
C48  22.48,54.4 0 top
C49  22.43,55.59 0 top
C50  1.52,4.03 90 top
C51  36.35,53.13 270 top
C52  3.86,19.09 90 top
C53  27.2,6.8 0 top
C55  6.5,3.93 270 top
C56  27.2,2 180 top
C57  -14.12,-10.59 0 top  (outside the outline)
C58  -14.23,-14.58 0 top  (outside the outline)
C59  -14.23,-26.98 0 top  (outside the outline)
C60  -14.23,-39.37 0 top  (outside the outline)
I1  4.7,10.13 180 top
I2  32.66,3.95 90 top
J1  14.04,12.79 180 bottom
J2  19.33,12.84 180 bottom
J3  31.62,17.67 0 bottom
J4  27.51,2.79 0 bottom
LED1  17.96,3.38 90 top
LED2  20.62,9.31 90 top
LED3  21.87,9.31 90 top
LED4  23.06,9.31 90 top
LED5  24.26,9.31 90 top
R1  24.44,21.39 225 bottom
R2  23.5,20.86 225 bottom
R3  5.31,15.92 270 bottom
R4  6.45,18.13 270 bottom
R5  34.43,37.11 135 bottom
R6  7.59,15.92 270 bottom
R7  19.23,3.38 270 top
R8  32.86,35.59 315 bottom
R9  4.77,6.65 180 top
R10  32.75,12.51 270 top
R11  29.46,3.88 90 top
R12  20.62,6.39 90 top
R13  21.87,6.39 90 top
R14  23.06,6.39 90 top
R15  24.26,6.39 90 top
R16  15.3,10.25 270 top
R17  16.2,14.49 0 top
R18  5.31,13.56 180 top
R19  36.8,3.22 90 top
S1  11.3,4.87 180 bottom
TP1  3.33,15.27 270 bottom
TP2  6.45,12.97 270 bottom
TP3  9.57,15.27 270 bottom
TP5  31.17,33.9 225 bottom
TP6  36.1,38.78 225 bottom
TP7  21.36,6.49 270 bottom
TP8  17.3,6.49 270 bottom
TP13  26.87,62.73 0 bottom
U1  33.69,61.05 270 top
U2  24.31,43.27 0 top
U3  6.45,36.62 90 top
U4  6.95,27.63 0 top
U5  33.61,35.13 180 top
U6  8.38,59.87 0 top
U7  3.99,3.98 90 top
U8  33.42,9.8 90 top
U9  6.95,45.61 0 top
U10  33.12,43.27 0 top
U11  24.27,18.46 225 top
U12  27.2,4.54 0 top
U13  13.64,22.65 90 top
U15  6.45,17.24 0 top
U17  18.13,55.84 90 top
U19  14.27,43.27 0 top
U21  16.86,31.77 180 top
U22  33.12,52.14 0 top
X1  10.26,9.99 0 top
X2  14.74,7.35 90 top

### Tracks (layer width: path | path; a pad name or v marks a point on that pad's centre or on a via)
1.2V
  Top 0.152: U11.P$56 28.14,14.19 28.16,14.19 | 30.24,10.88 C34.2
  Top 0.254: C32.2 C33.2 19.55,22.82 U11.P$25 U11.P$56
  Top 0.406: 28.16,14.19 29.91,12.45 | 29.91,12.45 30.55,11.8 30.55,11.06 C34.2 | C31.2 29.91,11.99 29.91,12.45
3.3V-A  (via drill 0.33)  (13 unrouted)
  Top 0.152: U9.P$14 7.45,46.58 7.21,46.35 6.2,46.35 5.94,46.61 U9.P$1 3.68,46.61 C26.2 2.98,46.11 | C8.1 U2.P$14 U2.P$15 24.31,44.14 24.18,44.01 23.57,44.01 23.31,44.27 U2.P$1 | C11.1 U19.P$14 U19.P$15 14.27,44.14 14.15,44.01 13.54,44.01 13.27,44.27 U19.P$1 | U3.P$15 U3.P$16 | U3.P$16 C12.2 2.98,36.12 | C9.1 4.39,34.87 4.92,35.39 U3.P$1 5.23,35.39 U3.P$16 | U1.P$8 33.68,60.82 34.09,61.23 U1.P$2 34.09,62.86 34.39,63.16 C2.1 C5.1 | U4.P$1 5.48,28.63 | U15.P$3 C52.1 | U17.P$16 U17.P$17 U17.P$18 | U17.P$15 U17.P$16 | U22.P$9 35.46,52.63 | U17.P$16 17.88,59.78 C27.1 17.96,60.21 | U10.P$1 | v34.29,45.53 34.2,45.53 34.16,45.57 | 33.62,44.95 U10.P$14 | U4.P$15 U4.P$14 | U4.P$15 | U4.P$15 6.95,28.61 6.73,28.39 6.2,28.39 5.93,28.63 U4.P$1 | C14.2 3.33,28.38 3.57,28.63 U4.P$1 | C20.2 4.42,60.9 5.33,60.9 5.77,60.87 U6.P$1 7.38,60.87 7.8,60.44 8.76,60.44 8.88,60.56 U6.P$14 | C16.1 36.83,36.21 | 36.83,36.21 C15.1 | U5.P$1 36.82,36.21 36.83,36.21 | U22.P$5 31.72,50.58 31.44,50.31 | 31.11,44.45 31.29,44.27
  Top 0.254: U1.P$8 33.69,59.33 34.46,58.56 C3.1 | 35.46,52.63 C51.2 | U22.P$9 U22.P$8 | U10.P$1 31.29,44.27 C29.2 | 34.2,45.53 33.62,44.95 | C16.1 36.21,37.36 35.99,37.58 35.99,40.86 | 35.99,40.86 35.99,49.57 35.25,50.31 | U5.P$4 31.74,36.66 35.94,40.86 35.99,40.86 | 34.16,46.98 31.85,46.98 31.11,46.24 31.11,44.45
  Top 0.406: C11.1 14.77,47.33 v15.34,47.9 15.34,49.93 14.96,50.31 | 24.81,48.46 v25.37,47.9 24.81,47.33 C8.1 | 35.46,54.4 35.46,52.63 | v36.09,54.4 35.46,54.4 | C28.1 34.16,45.57 34.16,46.98 34.16,49.67 33.53,50.31 | 2.98,46.11 v2.08,47.01 1.37,47.01 | 2.98,36.12 v2.08,35.22 1.37,35.22 | 1.37,29.02 1.37,35.22 | 1.37,35.22 1.37,47.01 | 1.37,47.01 1.37,50.31 | 1.37,50.31 1.37,60.87 | 1.37,60.87 1.37,64.41 16.1,64.41 16.1,62.07 v17.07,61.1 17.96,60.21 | 1.37,60.87 v2.34,60.87 2.91,60.3 C20.2 | 1.37,29.02 v2.08,29.02 2.98,28.13 C14.2 | 1.37,50.31 14.96,50.31 | 14.96,50.31 24.38,50.31 | 24.81,49.88 24.38,50.31 | 24.38,50.31 31.44,50.31 33.53,50.31 | 33.53,50.31 35.25,50.31 35.46,50.51 35.46,52.63 | 1.37,29.02 1.37,18.58 | C52.1 1.37,18.58 | C3.1 35.03,58.12 35.46,57.7 35.46,54.4 | 1.37,18.58 1.37,14.88 2.68,13.56 R18.2
  Bottom 0.152: 36.09,55.49 v36.09,54.4 | C19.P$1 35.42,46.66 v34.29,45.53
  Bottom 0.406: 16.26,47.9 v15.34,47.9 | 26.29,47.9 v25.37,47.9 | 2.08,47.62 v2.08,47.01 | 2.08,29.64 v2.08,29.02 | 2.08,34.61 v2.08,35.22 | 2.34,61.8 v2.34,60.87 | 16.45,61.1 v17.07,61.1
3.3V-B  (via drill 0.33)
  Top 0.152: U11.P$37 17.83,14.49 R17.2 | U11.P$11 28.07,24.02 C38.2 | U11.P$42 17.83,10.96 C40.2 | U11.P$54 28.44,12.51 C36.2 | 32.77,7.79 C23.1 | v36.78,6.93 36.6,6.93 | v15.34,18.63 v15.34,18.64
  Top 0.254: C35.2 18.86,22.8 U11.P$26 20.32,21.35 v20.32,21.14 | v26.69,22.65 U11.P$11 | v29.88,19.45 U11.P$2 30.93,20.52 C37.2 33.11,21.4 C39.2 | v26.77,14.19 U11.P$54 | 33.17,6.93 32.92,7.18 C23.1 32.92,8.25 32.77,8.4 U8.P$4 | U21.P$16 21.31,27.68 | U11.P$37 v19.72,16.38 | U11.P$42 v21.48,14.61 v21.48,14.62 | v15.34,18.64 14.66,18.64 12.31,20.98 U13.P$8
  Top 0.406: 33.17,6.93 36.6,6.93 | v35.05,18.38 36.78,16.65 v36.78,6.93 36.8,6.93 R19.2 | 21.31,27.68 v22.99,26
  Bottom 0.152: 17.8,18.3 | 26.66,22.61 v26.69,22.65 | 23.71,20.46 R2.2
  Bottom 0.254: J3.P$4 31.07,10.4 v31.6,9.87 31.6,8.02 | 19.76,16.34 v19.72,16.38 | 25.73,15.23 25.34,15.62
  Bottom 0.406: 17.8,18.3 19.76,16.34 v21.48,14.62 24.66,11.45 | 17.8,18.3 17.47,18.63 v15.34,18.63 | v36.78,6.93 32.69,6.93 31.6,8.02 30.38,9.24 26.87,9.24 24.66,11.45 | v35.05,18.38 30.95,18.38 v29.88,19.45 29.31,20.03 v26.69,22.65 25.14,21.09 R1.2 24.21,20.56 R2.2 | 26.21,14.75 25.34,15.62 20.32,20.64 v20.32,21.14 20.32,23.33 v22.99,26 | 26.21,14.75 v26.77,14.19 | 24.66,11.45 24.66,12.99 26.21,14.55 26.21,14.75
!CS-ADT7301  (via drill 0.33)
  Top 0.152: U21.P$11 14.96,26.94 13.64,25.62 v13.64,24.89 | U15.P$5 6.45,15.08 6.78,14.75 v12.04,14.75
  Bottom 0.152: v13.64,24.89 13.64,17.19 12.04,15.13 v12.04,14.75
!CS-ADXL362  (via drill 0.33)
  Top 0.152: U21.P$1 v21.31,36.21 | v30,38.45 31.67,38.45 33.62,40.39 U10.P$8
  Bottom 0.152: v21.31,36.21 22.33,37.23 28.4,37.23 v30,38.45
!CS-H3LIS331DLTR  (via drill 0.33)
  Top 0.152: U21.P$2 v20.04,37.2 | v24.33,38.5 25.07,39.23 25.07,41.39 24.81,41.65 U2.P$8
  Bottom 0.152: v24.33,38.5 21.33,38.5 v20.04,37.2
!CS-LIS3DH
  Top 0.152: U21.P$7 13.69,35.63 13.46,35.86 11.05,35.86 9.42,37.48 9.42,43.12 8.74,43.81 7.75,43.81 7.48,44.08 U9.P$8
!CS-LPS331
  Top 0.152: U21.P$10 13.69,27.35 12.34,26 7.45,26 U4.P$8
!CS-LS3GD20
  Top 0.152: U21.P$9 11.51,29.09 8.3,32.3 8.3,34.13 7.45,34.98 U3.P$5
!CS-LSM9D30-G  (via drill 0.33)
  Top 0.152: U21.P$3 v18.77,49.55 | U17.P$19 17.52,57.09 v18.77,55.84
  Bottom 0.152: v18.77,49.55 v18.77,55.84
!CS-LSM9DS0-XM  (via drill 0.33)
  Top 0.152: U21.P$4 v17.5,49.55 | 16.16,56.58 U17.P$20 16.75,56.59 v17.5,55.84
  Bottom 0.152: v17.5,49.55 v17.5,55.84
!CS-LSM303  (via drill 0.33)
  Top 0.152: v11.45,49.55 11.45,37.74 12.32,36.87 13.99,36.87 14.91,35.96 14.91,34.49 U21.P$6 | v11.45,56.91 10.41,57.95 9.42,57.95 8.88,58.5 U6.P$8
  Bottom 0.152: v11.45,49.55 v11.45,56.91
!CS-MAX21000
  Top 0.152: U21.P$5 16.23,37.13 15.37,37.99 15.37,41.04 14.77,41.63 U19.P$8
ANALOG-OUT-STLM20
  Top 0.152: U11.P$58 31.7,12.09 R10.2 32.75,10.81 U8.P$3
GND  (via drill 0.33)  (120 unrouted)
  Top 0.152: U11.P$55 27.78,13.86 | 19.67,14.94 U11.P$39 17.39,12.64 14.96,12.64 13.94,11.62 C44.2 | v2.08,44.21 2.98,45.11 C26.1 | v2.08,26.23 2.98,27.13 C14.1 | v2.08,38.01 2.98,37.12 C12.1 | v2.34,58.69 2.94,59.3 C20.1 | U11.P$12 27.43,24.1 27.43,25.44 27.48,25.49 28,25.49 C38.1 | U8.P$2 33.42,10.87 | 32.29,22.22 C39.1 | 31.41,21.32 C37.1 31.52,21.25 | C2.2 | C41.2 10.18,12.39 | 10.18,12.39 C42.1 | C11.2 13.77,47.33 v13.21,47.9 | C8.2 23.81,47.33 v23.24,47.9 23.81,48.46 | 10.18,12.39 10.18,12.97 10.77,13.55 12.6,13.55 14.73,15.69 17.61,15.69 U11.P$35 | v19.89,61.1 18.96,60.18 C27.2 | v31.95,45.53 32.04,45.53 C28.2
  Top 0.254: U11.P$3 30.64,20.95 31.24,20.95 C37.1 | 31.52,21.25 C39.1
  Bottom 0.152: 2.08,43.6 v2.08,44.21 | 2.08,25.62 v2.08,26.23 | 2.08,38.63 v2.08,38.01 | 2.34,57.79 v2.34,58.69 | 20.47,61.1 v19.89,61.1 | 12.29,47.9 v13.21,47.9 | 22.32,47.9 v23.24,47.9 | C19.P$2 30.82,46.64 30.85,46.64 v31.95,45.53
IND-LED-1
  Top 0.152: U11.P$45 20.62,11.63 LED2.A
IND-LED-2
  Top 0.152: U11.P$46 21.87,12.17 LED3.A
IND-LED-3
  Top 0.152: U11.P$47 22.2,11.79 22.2,11.32 23.06,10.46 LED4.A
IND-LED-4
  Top 0.152: U11.P$48 24.38,10.25 LED5.A
INT1-MAG3110
  Top 0.152: U11.P$1 31.4,19.42 32.92,19.42 37.62,24.12 37.62,58.82 37.03,59.4 34.47,59.4 34.09,59.78 U1.P$9
INT1-MPL311
  Top 0.152: U11.P$4 33.91,24.92 33.91,31.51 32.99,32.43 U5.P$6
INT2-ADXL362
  Top 0.152: U11.P$5 32.53,24.25 32.54,24.25 33.04,24.76 33.04,31.04 30.78,33.31 30.78,36.48 34.36,40.07 U10.P$9
INT2-H3LIS331
  Top 0.152: U11.P$9 29.59,24.13 29.59,29.09 25.93,32.74 25.93,42.18 25.84,42.27 U2.P$9
INT2-L3GD  (via drill 0.33, 0.33 pad 0.25)
  Top 0.152: U11.P$15 26.26,25.05 26.26,26.92 v22.88,30.29 | v8.96,36.12 U3.P$6
  Bottom 0.152: v22.88,30.29 22.83,30.37 11.43,30.37 8.96,32.83 v8.96,36.12
INT2-LIS3DH  (via drill 0.33)
  Top 0.152: 8.39,44.61 U9.P$9 9.42,44.61 10.44,43.59 v10.44,38.24 | U11.P$14 26.67,24.75 26.67,27.85 v22.88,31.64
  Bottom 0.152: v22.88,31.64 22.81,31.72 12.06,31.72 10.44,33.34 v10.44,38.24
INT2-LPS331  (via drill 0.33, 0.33 pad 0.15)
  Top 0.152: v9.04,26.63 U4.P$9 | U11.P$16 25.66,25.98 v25.02,26.63
  Bottom 0.152: v25.02,26.63 v9.04,26.63
INT2-LSM303  (via drill 0.33)
  Top 0.152: 10.01,58.87 U6.P$9 11.45,58.87 v13.41,56.91 | U11.P$10 28.73,23.98 28.73,28.49 22.88,34.33 22.88,38.24 20.04,41.09 20.04,48.02 v19.71,48.35
  Bottom 0.152: v13.41,56.91 13.49,56.84 13.49,50.05 14.78,48.76 19.3,48.76 v19.71,48.35
INT2-MAX21000  (via drill 0.33)
  Top 0.152: v16.03,38.62 16.03,42.15 15.9,42.27 U19.P$9 | U11.P$13 27.07,24.45 27.07,28.79 v22.88,32.99
  Bottom 0.152: v22.88,32.99 17.3,32.99 16.86,33.42 16.86,37.79 v16.03,38.62
LSM9D-DRGY-G  (via drill 0.33)
  Top 0.152: U11.P$8 30.45,24.29 30.45,29.58 26.95,33.08 v26.95,49.17 | U17.P$12 24.9,57.09 26.95,55.03 v26.95,52.85
  Bottom 0.152: v26.95,49.17 v26.95,52.85
LSM9D-INT1-XM  (via drill 0.33)
  Top 0.152: U11.P$7 31.32,24.45 31.32,30.06 27.96,33.42 v27.96,48.4 | U17.P$13 26.33,57.56 27.96,55.92 v27.96,52.09
  Bottom 0.152: v27.96,48.4 v27.96,52.09
LSM9D-INT2-XM  (via drill 0.33)
  Top 0.152: v28.98,49.17 28.98,33.75 32.18,30.55 32.18,24.6 U11.P$6 | v28.98,52.85 28.98,56.76 26.95,58.79 19.28,58.79 18.88,58.4 U17.P$14
  Bottom 0.152: v28.98,49.17 v28.98,52.85
MISO-A
  Top 0.152: U11.P$28 17.98,22.27 15.7,22.27 15.56,22.4 U13.P$2
MISO-B  (via drill 0.33, 0.41)
  Top 0.152: U6.P$7 8.38,55.87 7.59,55.08 v7.59,55.06 7.59,55.09 U17.P$23 U17.P$22 | U2.P$7 24.31,40.76 v24.43,40.68 | U15.P$6 7.4,17.07 v7.59,17.24 | U4.P$7 6.95,25.53 v7.59,24.88 | U3.P$4 6.95,34.31 7.52,33.75 v7.59,33.75 | U19.P$7 14.27,40.78 v14.37,40.68 | U10.P$7 33.12,40.99 32.82,40.68 v31.77,40.68 | U9.P$7 6.95,43.69 v7.16,43.48 | U13.P$6 10.59,22.9 v10.34,22.65
  Bottom 0.152: 7.59,40.68 v7.59,33.75 v7.59,24.88 7.59,22.71 | 7.59,40.68 7.59,43.35 | 7.59,43.35 v7.59,55.06 | v31.77,40.68 v24.43,40.68 v14.37,40.68 7.59,40.68 | 7.59,22.71 v7.59,17.24 7.59,16.8 7.4,16.6 7.56,16.6 R6.1 | v7.16,43.48 7.47,43.48 7.59,43.35 | v10.34,22.65 7.64,22.65 7.59,22.71
MOSI-A  (via drill 0.33)
  Top 0.152: U11.P$29 17.9,21.64 v16.36,21.64 | 14.99,22.93 U13.P$3 15.98,22.9 v16.03,22.86
  Bottom 0.152: v16.36,21.64 16.03,21.97 v16.03,22.86
MOSI-B  (via drill 0.33)
  Top 0.152: U6.P$6 7.87,58.24 7.87,56.66 6.45,55.26 v6.45,54.02 6.77,54.06 14.8,54.06 15.32,54.59 U17.P$24 | v8.53,39.56 v6.45,39.56 | U19.P$6 13.77,39.68 v13.79,39.56 | U2.P$6 23.81,39.68 v23.82,39.56 | U4.P$6 v6.45,23.4 U13.P$5 | U3.P$3 v6.45,33.04 | v30.73,39.56 30.73,41.04 31.44,41.75 32.37,41.75 U10.P$6 | v6.45,19.45 U15.P$2 | U9.P$6 v6.45,45.36 | U4.P$6
  Bottom 0.152: 6.45,41.95 v6.45,39.56 | v6.45,39.56 v6.45,33.04 v6.45,23.4 v6.45,19.45 R4.1 | v6.45,39.56 v6.45,45.36 v6.45,54.02 | v30.73,39.56 v23.82,39.56 v13.79,39.56 v8.53,39.56
N$1
  Top 0.152: C1.1 35.48,63.08 34.61,62.2 U1.P$1
N$2
  Bottom 0.61: J1.P$1 11.47,8.89 10.55,7.98 S1.2
N$3
  Top 0.152: C4.1 32.15,63.36 32.38,63.14 33.07,63.14 33.29,62.92 U1.P$4
N$4
  Top 0.152: C10.1 4.14,37.78 4.8,37.12 U3.P$14
N$5
  Top 0.152: C17.1 U5.P$2
N$6
  Top 0.152: U6.P$15 C18.1
N$7
  Top 0.152: C21.2 5.3,60.37 U6.P$2
N$8
  Top 0.152: U17.P$7 20.89,54.59 21.03,54.45 21.78,54.45 C48.1
N$9
  Top 0.152: R10.1 33.83,12.94 C24.2
N$10
  Top 0.152: U11.P$38 17.93,13.88 15.75,13.88 | R17.1 15.75,14.46 15.75,13.88 | 15.75,13.88 15.75,13.34 C30.2
N$11
  Top 0.152: X1.P$2 11.93,10.66 C42.2 12.19,12.39 15.01,15.21 17.83,15.21 U11.P$36
N$12
  Top 0.152: U11.P$34 17.38,16.17 14.45,16.17 12.32,14.04 9.37,14.04 8.49,13.16 C41.1 8.49,10.61 X1.P$1
N$13
  Top 0.152: 3.2,9.97 I1.2
  Top 0.254: U7.7 3.74,5.55 3.2,6.09 3.2,9.97
N$14
  Top 0.152: R16.2 15.35,9.78 C43.1 16.43,7.15 X2.P$1
N$15
  Top 0.152: U6.P$3 5.93,59.87 5.35,59.3 C21.1
N$16
  Top 0.152: U11.P$40 20.04,14.57 17.55,12.13 15.37,12.13 14.6,11.37 14.6,10.07 14.38,9.85 C44.1 X2.P$3 13.94,8.46
N$17
  Top 0.152: 20.39,14.23 U11.P$41 17.71,11.55 15.62,11.55 15.3,11.23 R16.1
N$18
  Top 0.152: LED5.C R15.2
N$19
  Top 0.406: 6.35,6.65 I1.1 6.35,13.37 R18.1 | 6.35,6.65 6.35,4.99 C55.1 | R9.1 6.35,6.65
N$21
  Top 0.152: C49.2 22.93,55.03 20.45,55.03 20.39,55.09 U17.P$8
N$22
  Top 0.152: U17.P$9 21.78,55.59 C49.1
N$23
  Top 0.254: R9.2 4.24,6.51
  Top 0.406: 4.24,6.51 U7.6
N$24
  Bottom 0.152: TP6.P$1 R5.2
N$25
  Top 0.152: C56.1 28.42,2.3
  Top 0.254: 28.42,2.3 29.46,2.3 | 29.46,2.3 I2.1 | R11.1 29.46,2.3
  Top 0.406: I2.1 36.73,2.3 R19.1
N$26
  Bottom 0.152: TP5.P$1 R8.2
N$27
  Top 0.254: LED1.A 18.28,3.81 R7.1
N$29
  Top 0.152: LED4.C R14.2
N$31
  Top 0.152: LED3.C R13.2
N$32
  Bottom 0.152: TP1.P$1 R3.2
N$33
  Bottom 0.152: TP2.P$1 R4.2
N$34
  Bottom 0.152: R6.2 TP3.P$1
N$35
  Top 0.152: LED2.C R12.2
N$36
  Top 0.254: U12.7 28.65,4.79 29.46,5.6 I2.2
N$37
  Top 0.152: U12.6
  Top 0.254: U12.6 R11.2
POWER-IN  (via drill 0.46)
  Top 0.152: 1.57,3.17 C50.1 | 26.29,5.32 U12.1
  Top 0.254: U12.1 26.25,5.54 26.41,5.71 | R7.2 19.25,2.93 19.25,1.44
  Top 0.406: U7.8 2.93,4.93 2.79,4.79 2.79,3.17 | 2.79,3.17 2.93,3.03 U7.1 3.24,1.86 | 2.79,3.17 1.57,3.17 | U12.8 28.15,5.54 27.99,5.71 26.41,5.71 | C53.1 26.29,5.32 | 25.36,5.29 U12.1
  Top 0.61: 3.24,1.86 3.66,1.44 v8.79,1.44 19.25,1.44 23.52,1.44 24.92,2.84 24.92,4.84 25.36,5.29
  Bottom 0.61: S1.1 9.05,5.67 8.79,5.4 v8.79,1.44
SCL-0  (via drill 0.33)
  Top 0.152: U1.P$7 33.29,54.59 v33.71,54.17 34.52,53.36 U22.P$10 | v35.49,35.13 U5.P$8 | U11.P$23 21.11,22.67 21.51,22.67 22.02,23.18 22.63,23.18 v23.42,22.39
  Bottom 0.152: 34.13,36.72 R5.1 33.97,36.65 | 33.97,36.65 33.74,36.88 33.74,54.14 v33.71,54.17 | 33.97,36.65 v35.49,35.13 35.49,34.47 v23.42,22.39 24.12,21.69 R1.1
SCLK-A
  Top 0.152: 14.98,21.89 U13.P$1 14.96,21.79 15.77,20.98 17.86,20.98 U11.P$30
SCLK-B  (via drill 0.33, 0.41)
  Top 0.152: U10.P$4 v30.55,42.78 | U9.P$4 4.77,45.11 v4.37,45.51 | U17.P$21 v9.28,56.09 | U15.P$4 5.5,17.12 v5.31,17.24 | v5.31,42.78 v8.53,42.78 | U19.P$4 v14.02,42.78 | U2.P$4 v24.05,42.78 | U3.P$2 5.95,34.31 5.38,33.75 v5.31,33.75 | U6.P$4 6.58,59.38 v6.37,59.17 | U4.P$4 5.73,27.14 4.7,27.14 v4.57,27.27 | v5.31,21.89 10.91,21.89 11.43,22.4 U13.P$7
  Bottom 0.152: 5.31,27.14 v5.31,21.89 v5.31,17.24 R3.1 | 5.31,27.14 v5.31,33.75 v5.31,42.78 5.31,45.1 | v8.53,42.78 v14.02,42.78 v24.05,42.78 v30.55,42.78 | 5.31,45.1 5.31,55.62 5.76,56.09 | 5.76,56.09 5.76,58.56 v6.37,59.17 | v4.37,45.51 4.77,45.1 5.31,45.1 | v9.28,56.09 5.76,56.09 | v4.57,27.27 4.7,27.14 5.31,27.14
SD-CARD-INSERT  (via drill 0.33)
  Top 0.152: U11.P$60 30.94,14.26 v34.69,14.26
  Bottom 0.152: v34.69,14.26 35.13,13.83 J3.P$8
SD-CS  (via drill 0.33)
  Top 0.152: U11.P$62 31.14,15.47 v31.29,15.46
  Bottom 0.152: J3.P$2 28.87,12.48 31.29,14.9 v31.29,15.46
SD-MISO  (via drill 0.33)
  Top 0.152: U11.P$63 31.27,16.05 v33.81,16.05
  Bottom 0.152: J3.P$7 34.37,11.8 33.78,12.39 33.78,16.03 v33.81,16.05
SD-MOSI  (via drill 0.33)
  Top 0.152: U11.P$64 31.37,16.66 v31.9,16.66
  Bottom 0.152: J3.P$3 29.97,12.06 31.9,13.99 v31.9,16.66
SD-SCLK  (via drill 0.33)
  Top 0.152: U11.P$61 31.04,14.87 v32.61,14.87
  Bottom 0.152: J3.P$5 32.17,11.64 32.61,12.08 v32.61,14.87
SDA-0  (via drill 0.33)
  Top 0.152: U1.P$6 32.89,54.59 v32.48,54.17 31.72,53.43 U22.P$1 | v34.24,35.13 34.24,34.84 U5.P$7 | U11.P$24 20.96,22.11 21.94,22.11 v22.09,22.26
  Bottom 0.152: 33.27,35.93 R8.1 33.16,35.95 33.29,36.08 | 34.24,34.36 34.24,34.38 | 34.24,34.38 v34.24,35.13 33.29,36.08 | 33.29,36.08 32.5,36.87 32.5,54.14 v32.48,54.17 | 34.24,34.38 v22.09,22.26 23.17,21.18 23.2,21.18 R2.1
SPI-ADDR0
  Top 0.152: U11.P$17 20.04,27.99 U21.P$15
SPI-ADDR1
  Top 0.152: U11.P$18 19.21,28.11 18.92,28.11 18.77,28.26 U21.P$14
SPI-ADDR2
  Top 0.152: U11.P$19 18.99,27.63 17.88,27.63 17.5,28.01 U21.P$13
SPI-ADDR3
  Top 0.152: U11.P$20 18.76,27.14 16.71,27.14 16.23,27.63 U21.P$12
SWCLK  (via drill 0.33)
  Top 0.152: U11.P$52 27.07,12.47 27.07,10.76 29.01,8.83 v29.01,8.14
  Bottom 0.152: J4.P$1 v29.01,8.14
SWDIO  (via drill 0.33)
  Top 0.152: U11.P$51 26.72,12.12 26.72,10.51 27.99,9.24 v27.99,8.14
  Bottom 0.152: J4.P$2 27.99,6.7 v27.99,8.14
SWO  (via drill 0.33)
  Top 0.152: U11.P$49 25.96,11.47 25.96,10.97 25.96,9.76 v25.96,8.14
  Bottom 0.152: J4.P$4 25.96,6.73 v25.96,8.14
TDI  (via drill 0.33)
  Top 0.152: U11.P$50 26.34,11.79 26.34,10.23 26.97,9.59 v26.97,8.14
  Bottom 0.152: J4.P$3 26.97,6.72 v26.97,8.14
U6RX  (via drill 0.33)
  Top 0.152: U11.P$43 18.82,11.24 v18.82,10.81
  Bottom 0.152: v18.82,10.81 18.83,10.78 J2.P$1 18.83,8.28 17.3,6.75 TP8.P$1 17.3,7.41
U6TX  (via drill 0.33)
  Top 0.152: U11.P$44 19.84,11.55 v19.84,10.81
  Bottom 0.152: v19.84,10.81 J2.P$2 19.83,8.28 21.36,6.75 TP7.P$1